# EAGLE design tfp401_board (EAGLE 6.6.0)

## Sheet 1 of 4
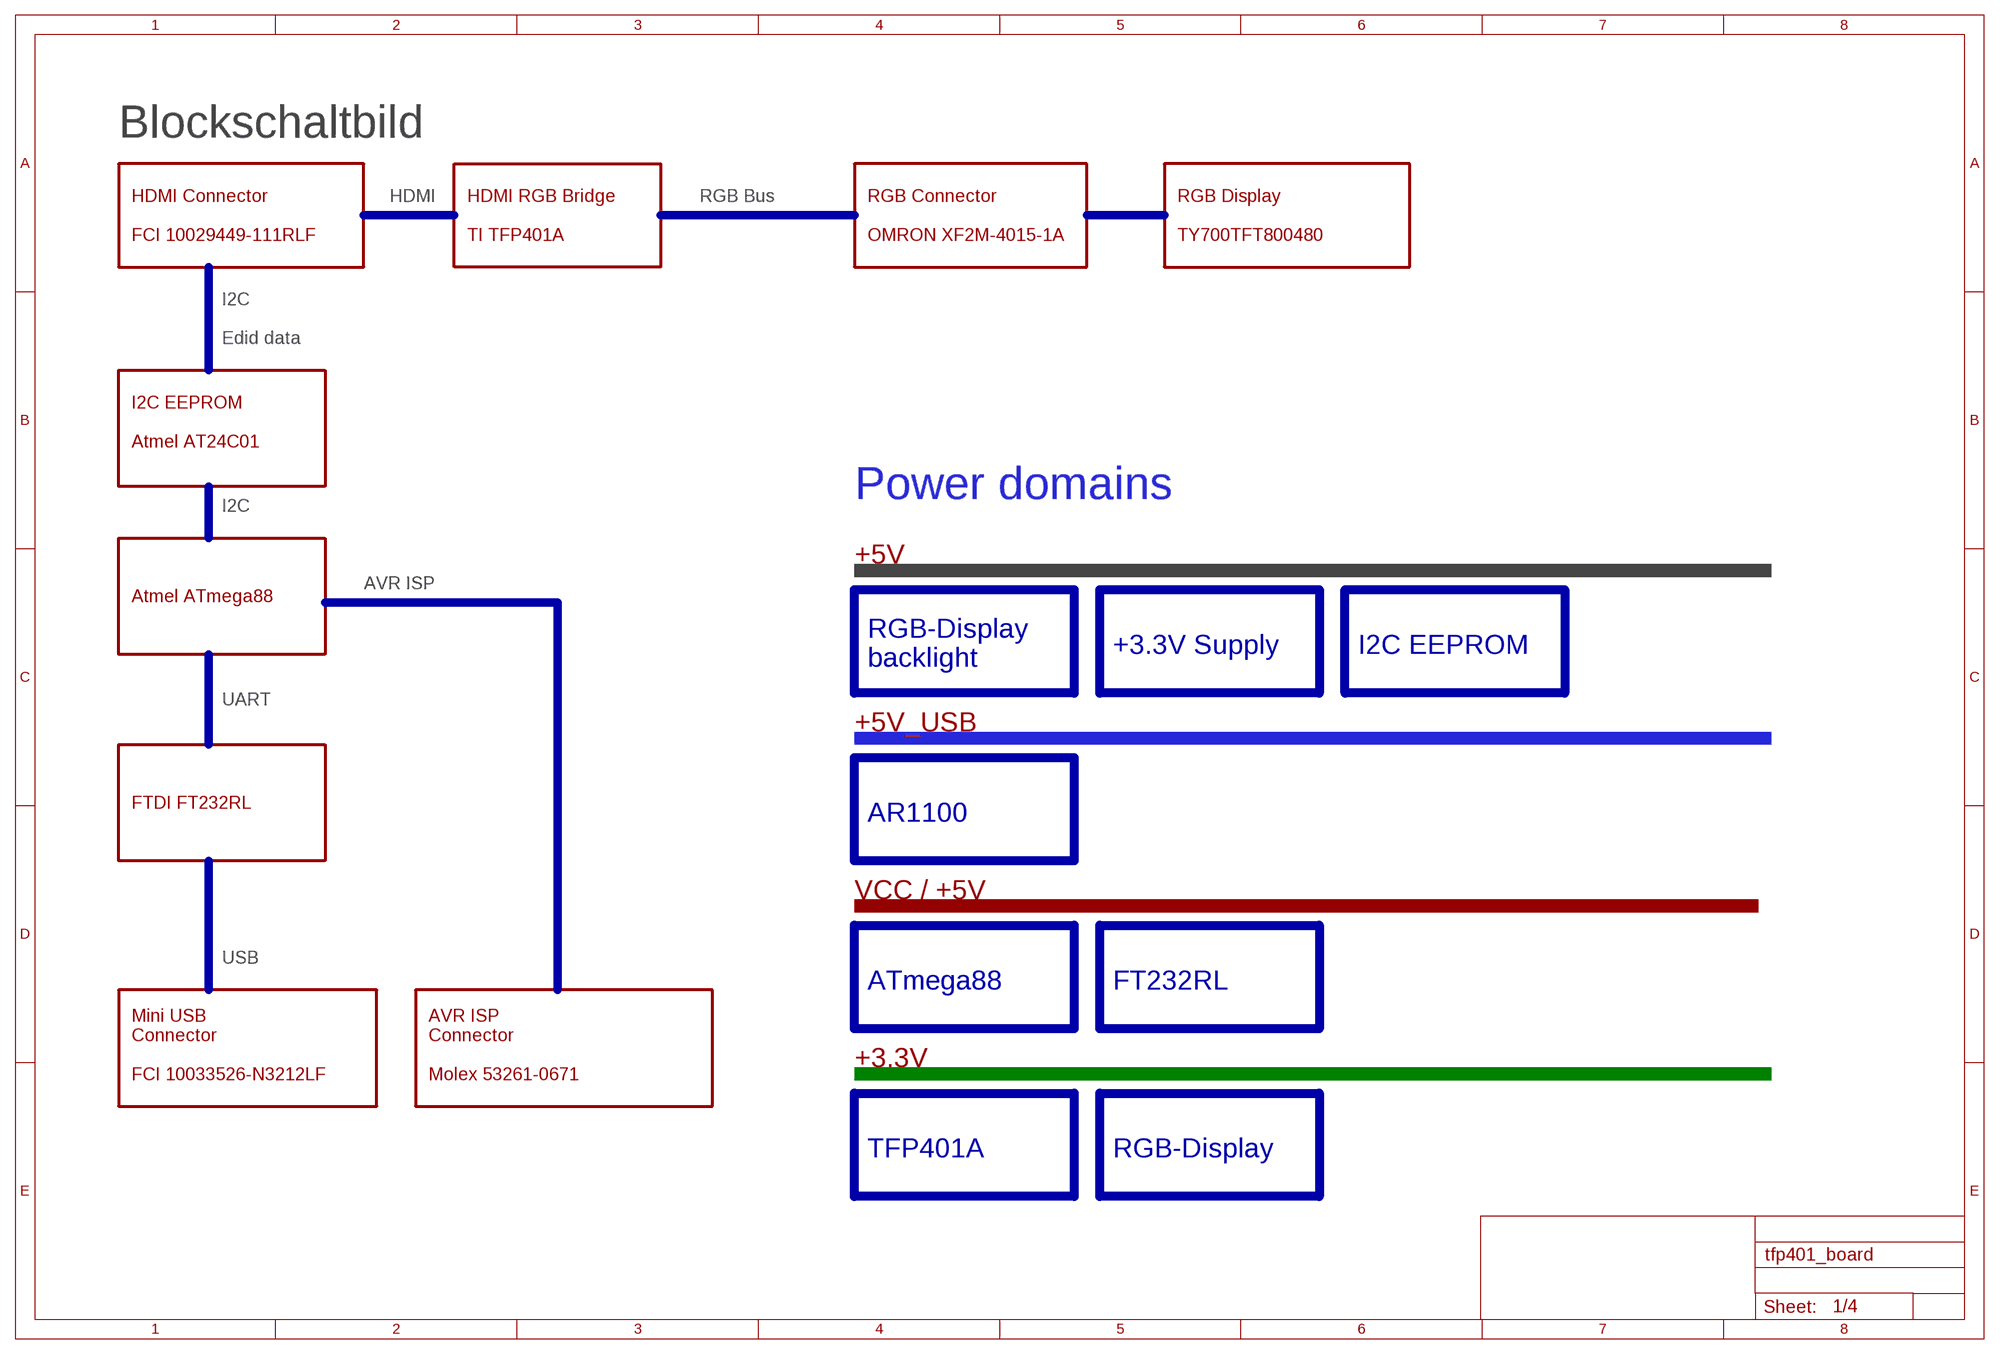
[diagram p0: schematic, sheet 1]

### Parts
U$15  FRAME_A3_LANDSCAPE  [FRAME]

### Buses
B$1
B$5
B$6
B$7
B$8
B$10
B$11
B$12

### Notes on the sheet
- Blockschaltbild
- HDMI | RGB Bus
- HDMI Connector
  
  FCI 10029449-111RLF
- HDMI RGB Bridge
  
  TI TFP401A
- RGB Connector
  
  OMRON XF2M-4015-1A
- RGB Display
  
  TY700TFT800480
- I2C
- Edid data
- I2C EEPROM
  
  Atmel AT24C01
- Power domains
- I2C
- +5V
- AVR ISP
- Atmel ATmega88
- +3.3V Supply | I2C EEPROM
- RGB-Display
  backlight
- UART
- +5V_USB
- FTDI FT232RL
- AR1100
- VCC / +5V
- USB
- ATmega88 | FT232RL
- +3.3V
- Mini USB
  Connector
  
  FCI 10033526-N3212LF
- AVR ISP
  Connector
  
  Molex 53261-0671
- TFP401A | RGB-Display

## Sheet 2 of 4
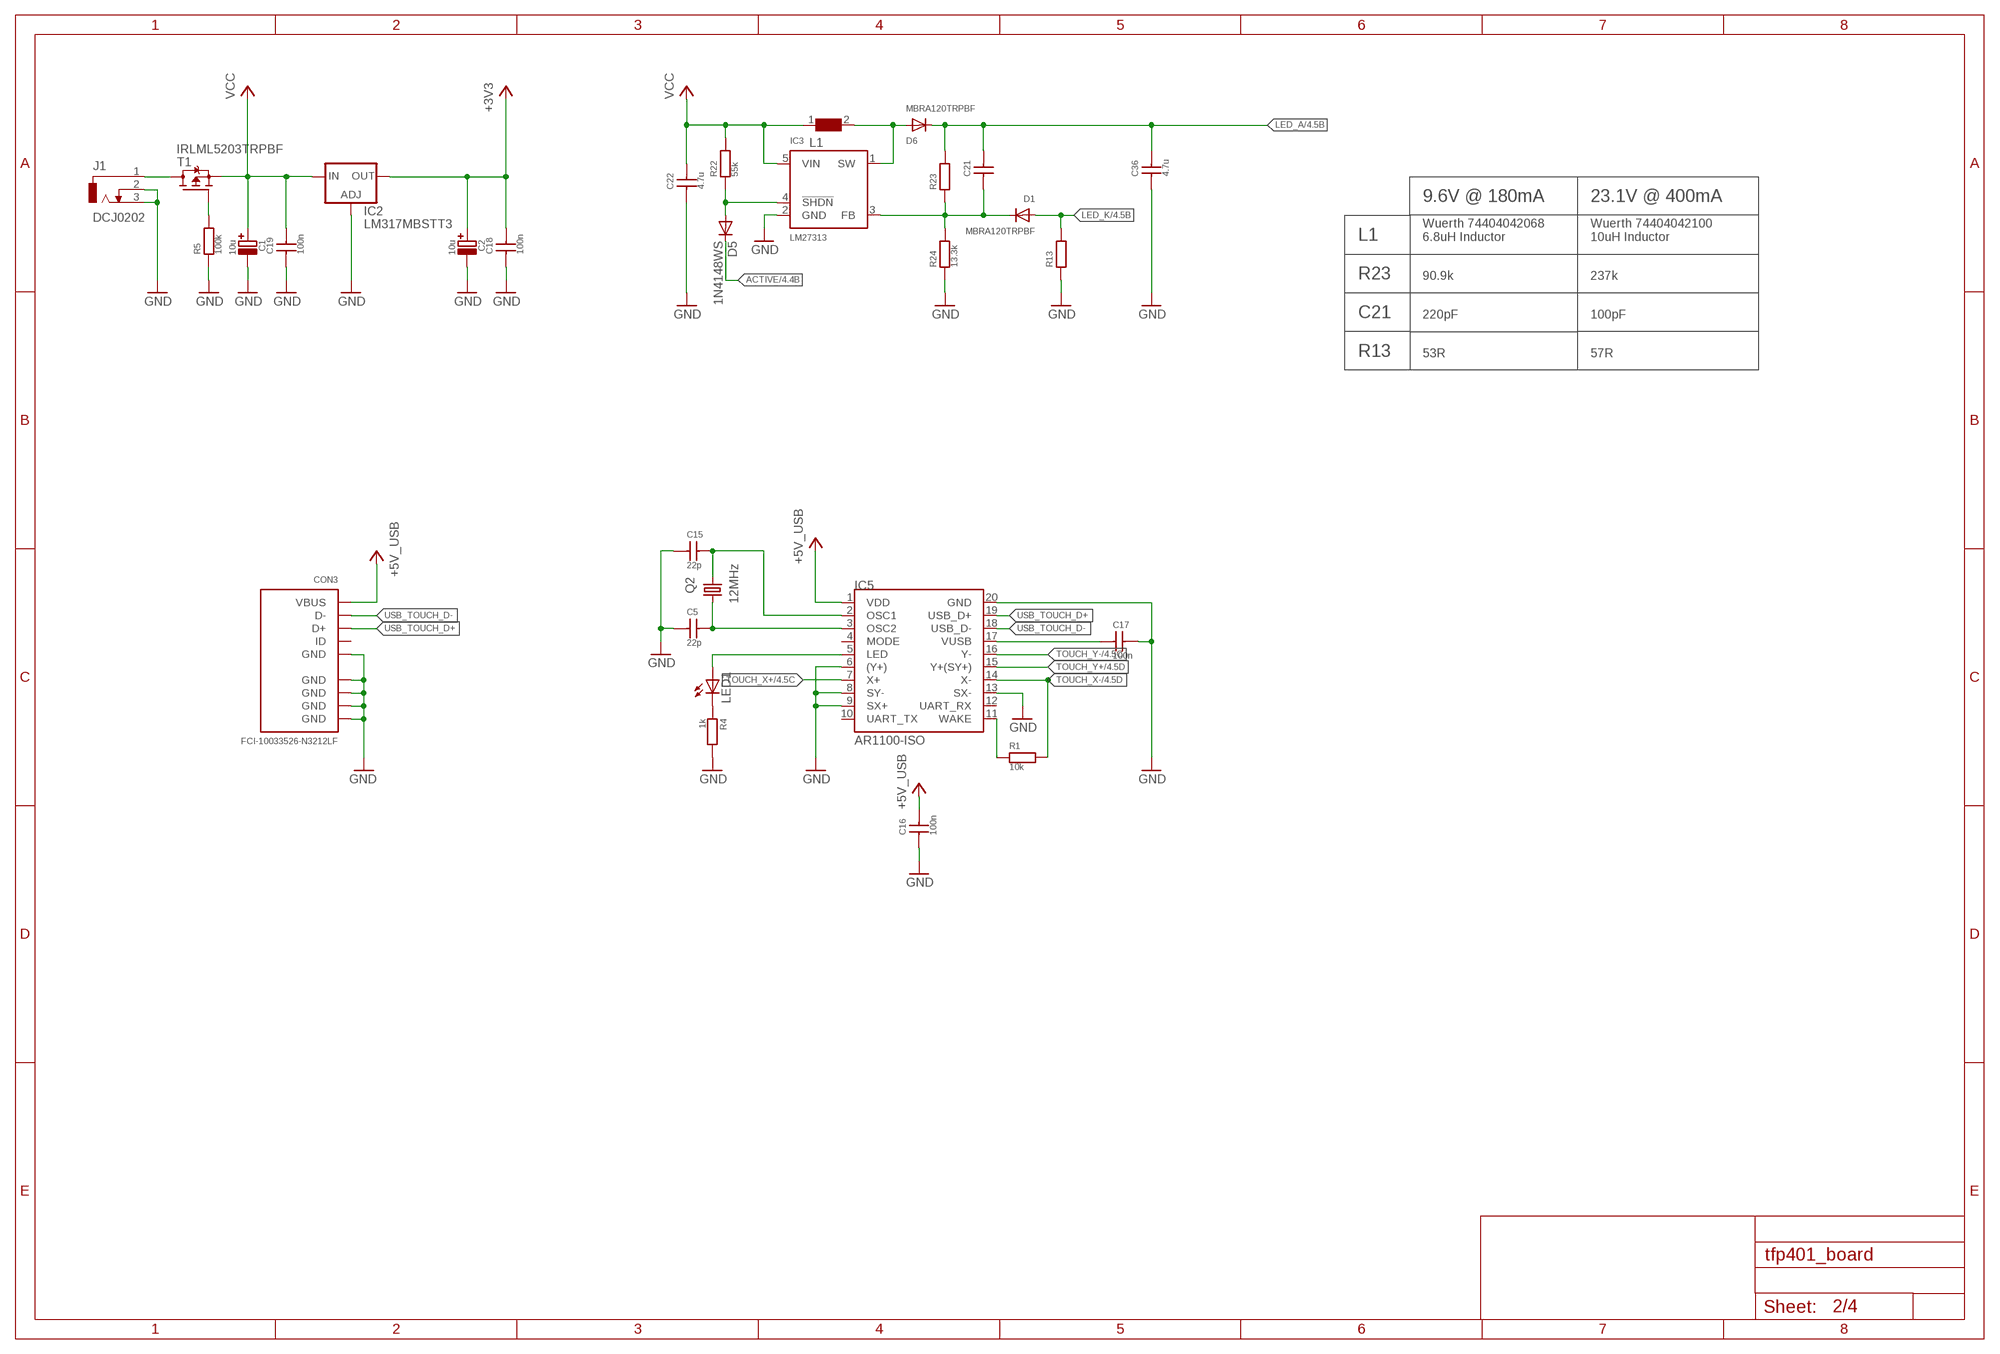
[diagram p1: schematic, sheet 2]

### Parts
C1  10u  C_POL4X4MM  [C_POL_4X4MM]
C2  10u  C_POL4X4MM  [C_POL_4X4MM]
C5  22p  C_SMD0603  [C0603]
C15  22p  C_SMD0603  [C0603]
C16  100n  C_SMD0603  [C0603]
C17  100n  C_SMD0603  [C0603]
C18  100n  C_SMD0603  [C0603]
C19  100n  C_SMD0603  [C0603]
C21  C_SMD0603  [C0603]
C22  4.7u  C_SMD1206  [C1206]
C36  4.7u  C_SMD1206  [C1206]
CON3  FCI-10033526-N3212LF  [FCI-10033526-N3212LF]
D1  MBRA120TRPBF  DIODESMA  [SMADIODE]
D5  1N4148WS  DIODE-SOD323-W  [SOD323-W]
D6  MBRA120TRPBF  DIODESMA  [SMADIODE]
IC2  LM317MBSTT3  [SOT223]
IC3  LM27313  [SOT23-5]
IC5  AR1100-ISO  [SOIC20]
J1  DCJ0202  [DCJ0202]
L1  WE-LQS_4018  [WE-LQS_4018]
LED1  LEDCHIP-LED0805  [CHIP-LED0805]
Q2  12MHz  ATS073ASM-1  [HC49/USSM]
R1  10k  R0603  [R0603]
R4  1k  R0603  [R0603]
R5  100k  R0603  [R0603]
R13  R2512  [R2512]
R22  55k  R0603  [R0603]
R23  R0603  [R0603]
R24  13.3k  R0603  [R0603]
T1  IRLML5203TRPBF  [SOT23]
U$2  FRAME_A3_LANDSCAPE  [FRAME]

### Nets
+3V3: C2.+ C18.2 IC2.4(OUT) ; also sheet 4
+5V_USB: C16.2 CON3.1(VBUS) IC5.1(VDD)
ACTIVE: D5.C ; also sheet 4
GND: C1.- C2.- C5.1 C15.1 C16.1 C17.2 C18.1 C19.1 C22.1 C36.1 CON3.5(GND) CON3.GND@1(GND) CON3.GND@2(GND) CON3.GND@3(GND) CON3.GND@4(GND) IC2.1(ADJ) IC3.2(GND) IC5.6((Y+)) IC5.8(SY-) IC5.9(SX+) IC5.13(SX-) IC5.20(GND) J1.2 J1.3 R4.2 R5.1 R13.1 R24.1 ; also sheet 3,4
LED_A: C21.2 C36.2 D6.C R23.2 ; also sheet 4
LED_K: D1.A R13.2 ; also sheet 4
N$1: R5.2 T1.1(G)
N$2: IC5.11(WAKE) R1.1
N$3: C17.1 IC5.17(VUSB)
N$4: LED1.C R4.1
N$5: C15.2 IC5.2(OSC1) Q2.1
N$6: J1.1 T1.3(D)
N$7: C5.2 IC5.3(OSC2) Q2.2
N$8: D6.A IC3.1(SW) L1.2
N$9: D5.A IC3.4(!SHDN) R22.1
N$10: IC5.5(LED) LED1.A
N$11: C21.1 D1.C IC3.3(FB) R23.1 R24.2
TOUCH_X+: IC5.7(X+) ; also sheet 4
TOUCH_X-: IC5.14(X-) R1.2 ; also sheet 4
TOUCH_Y+: IC5.15(Y+(SY+)) ; also sheet 4
TOUCH_Y-: IC5.16(Y-) ; also sheet 4
USB_TOUCH_D+: CON3.3(D+) IC5.19(USB_D+)
USB_TOUCH_D-: CON3.2(D-) IC5.18(USB_D-)
VCC: C1.+ C19.2 C22.2 IC2.3(IN) IC3.5(VIN) L1.1 R22.2 T1.2(S) ; also sheet 3,4
Unconnected: CON3.4(ID) IC5.4(MODE) IC5.10(UART_TX) IC5.12(UART_RX)

### Notes on the sheet
- 9.6V @ 180mA | 23.1V @ 400mA
- L1
- Wuerth 74404042068
  6.8uH Inductor
- Wuerth 74404042100
  10uH Inductor
- R23 | 90.9k | 237k
- C21 | 220pF | 100pF
- R13 | 53R | 57R

## Sheet 3 of 4
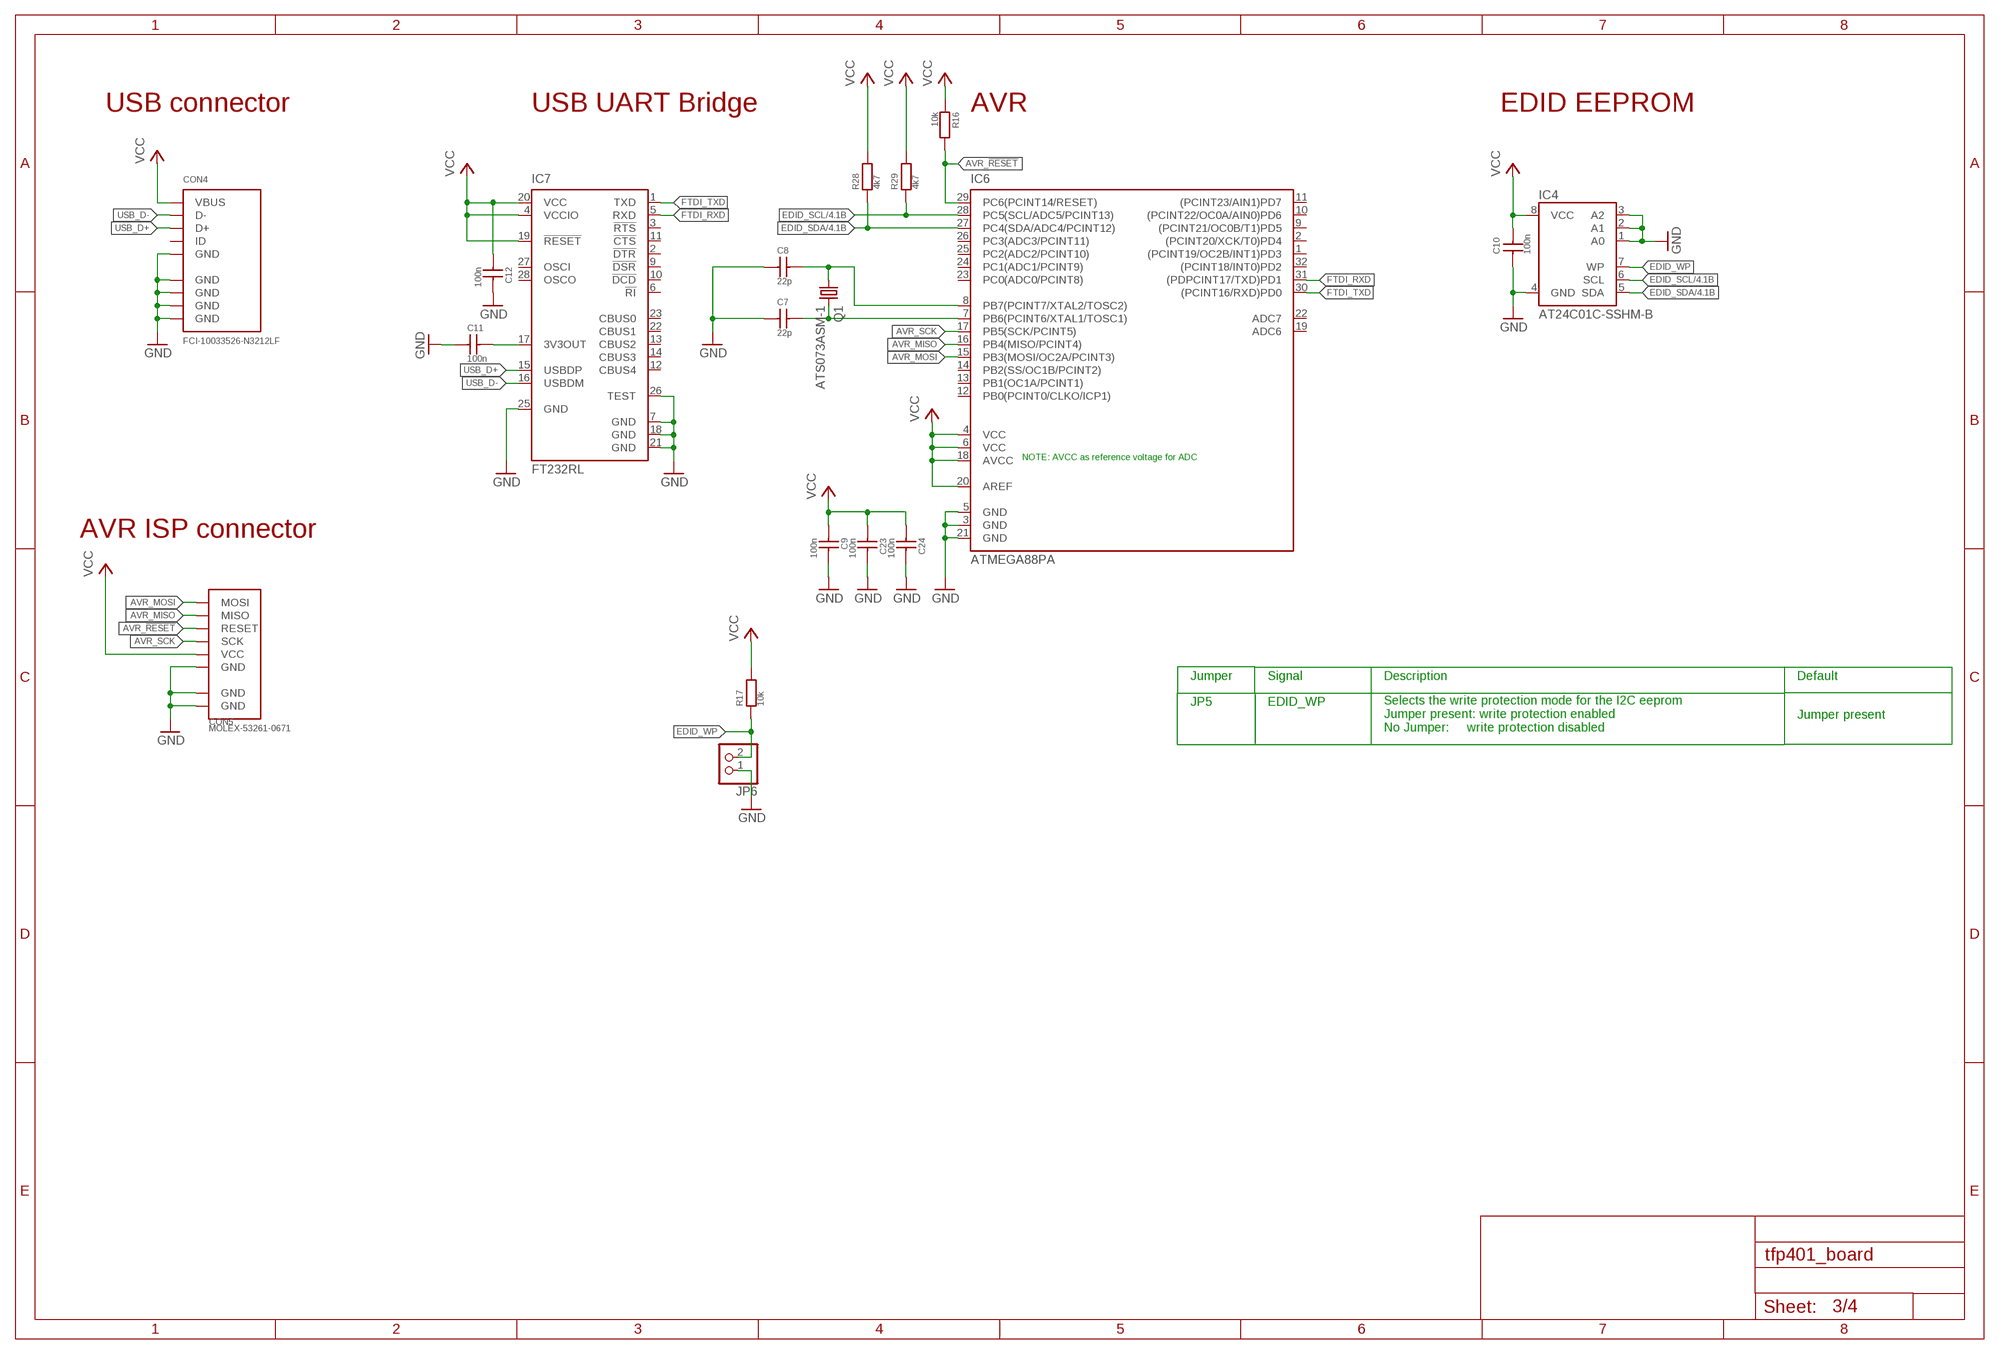
[diagram p2: schematic, sheet 3]

### Parts
C7  22p  C_SMD0603  [C0603]
C8  22p  C_SMD0603  [C0603]
C9  100n  C_SMD0603  [C0603]
C10  100n  C_SMD0603  [C0603]
C11  100n  C_SMD0603  [C0603]
C12  100n  C_SMD0603  [C0603]
C23  100n  C_SMD0603  [C0603]
C24  100n  C_SMD0603  [C0603]
CON4  FCI-10033526-N3212LF  [FCI-10033526-N3212LF]
CON5  MOLEX-53261-0671  [MOLEX-53261-0671]
IC4  AT24C01C-SSHM-B  [SOIC8]
IC6  ATMEGA88PA  ATMEGA48A-AU  [TQFP32]
IC7  FT232RL  [SSOP28]
JP6  PINHD-1X02_2.54-SMD-90°  [1X02SMD/90]
Q1  ATS073ASM-1  [HC49/USSM]
R16  10k  R0603  [R0603]
R17  10k  R0603  [R0603]
R28  4k7  R0603  [R0603]
R29  4k7  R0603  [R0603]
U$4  FRAME_A3_LANDSCAPE  [FRAME]

### Nets
AVR_!RESET: CON5.3(RESET) IC6.29(PC6(PCINT14/RESET)) R16.2
AVR_MISO: CON5.2(MISO) IC6.16(PB4(MISO/PCINT4))
AVR_MOSI: CON5.1(MOSI) IC6.15(PB3(MOSI/OC2A/PCINT3))
AVR_SCK: CON5.4(SCK) IC6.17(PB5(SCK/PCINT5))
AVR_XTAL1: C7.2 IC6.7(PB6(PCINT6/XTAL1/TOSC1)) Q1.2
AVR_XTAL2: C8.2 IC6.8(PB7(PCINT7/XTAL2/TOSC2)) Q1.1
EDID_SCL: IC4.6(SCL) IC6.28(PC5(SCL/ADC5/PCINT13)) R29.1 ; also sheet 4
EDID_SDA: IC4.5(SDA) IC6.27(PC4(SDA/ADC4/PCINT12)) R28.1 ; also sheet 4
EDID_WP: IC4.7(WP) JP6.2 R17.1
FTDI_3V3OUT: C11.2 IC7.17(3V3OUT)
FTDI_RXD: IC6.31((PDPCINT17/TXD)PD1) IC7.5(RXD)
FTDI_TXD: IC6.30((PCINT16/RXD)PD0) IC7.1(TXD)
GND: C7.1 C8.1 C9.2 C10.1 C11.1 C12.2 C23.2 C24.2 CON4.5(GND) CON4.GND@1(GND) CON4.GND@2(GND) CON4.GND@3(GND) CON4.GND@4(GND) CON5.6(GND) CON5.GND@1(GND) CON5.GND@2(GND) IC4.1(A0) IC4.2(A1) IC4.3(A2) IC4.4(GND) IC6.3(GND) IC6.5(GND) IC6.21(GND) IC7.7(GND) IC7.18(GND) IC7.21(GND) IC7.25(GND) IC7.26(TEST) JP6.1 ; also sheet 2,4
USB_D+: CON4.3(D+) IC7.15(USBDP)
USB_D-: CON4.2(D-) IC7.16(USBDM)
VCC: C9.1 C10.2 C12.1 C23.1 C24.1 CON4.1(VBUS) CON5.5(VCC) IC4.8(VCC) IC6.4(VCC) IC6.6(VCC) IC6.18(AVCC) IC6.20(AREF) IC7.4(VCCIO) IC7.19(!RESET) IC7.20(VCC) R16.1 R17.2 R28.2 R29.2 ; also sheet 2,4
Unconnected: CON4.4(ID) IC6.1((PCINT19/OC2B/INT1)PD3) IC6.2((PCINT20/XCK/T0)PD4) IC6.9((PCINT21/OC0B/T1)PD5) IC6.10((PCINT22/OC0A/AIN0)PD6) IC6.11((PCINT23/AIN1)PD7) IC6.12(PB0(PCINT0/CLKO/ICP1)) IC6.13(PB1(OC1A/PCINT1)) IC6.14(PB2(SS/OC1B/PCINT2)) IC6.19(ADC6) IC6.22(ADC7) IC6.23(PC0(ADC0/PCINT8)) IC6.24(PC1(ADC1/PCINT9)) IC6.25(PC2(ADC2/PCINT10)) IC6.26(PC3(ADC3/PCINT11)) IC6.32((PCINT18/INT0)PD2) IC7.2(!DTR) IC7.3(!RTS) IC7.6(!RI) IC7.9(!DSR) IC7.10(!DCD) IC7.11(!CTS) IC7.12(CBUS4) IC7.13(CBUS2) IC7.14(CBUS3) IC7.22(CBUS1) IC7.23(CBUS0) IC7.27(OSCI) IC7.28(OSCO)

### Notes on the sheet
- USB connector | USB UART Bridge | AVR | EDID EEPROM
- NOTE: AVCC as reference voltage for ADC
- AVR ISP connector
- Jumper | Signal | Description | Default
- JP5 | EDID_WP
- Jumper present
- Selects the write protection mode for the I2C eeprom
  Jumper present: write protection enabled
  No Jumper:     write protection disabled

## Sheet 4 of 4
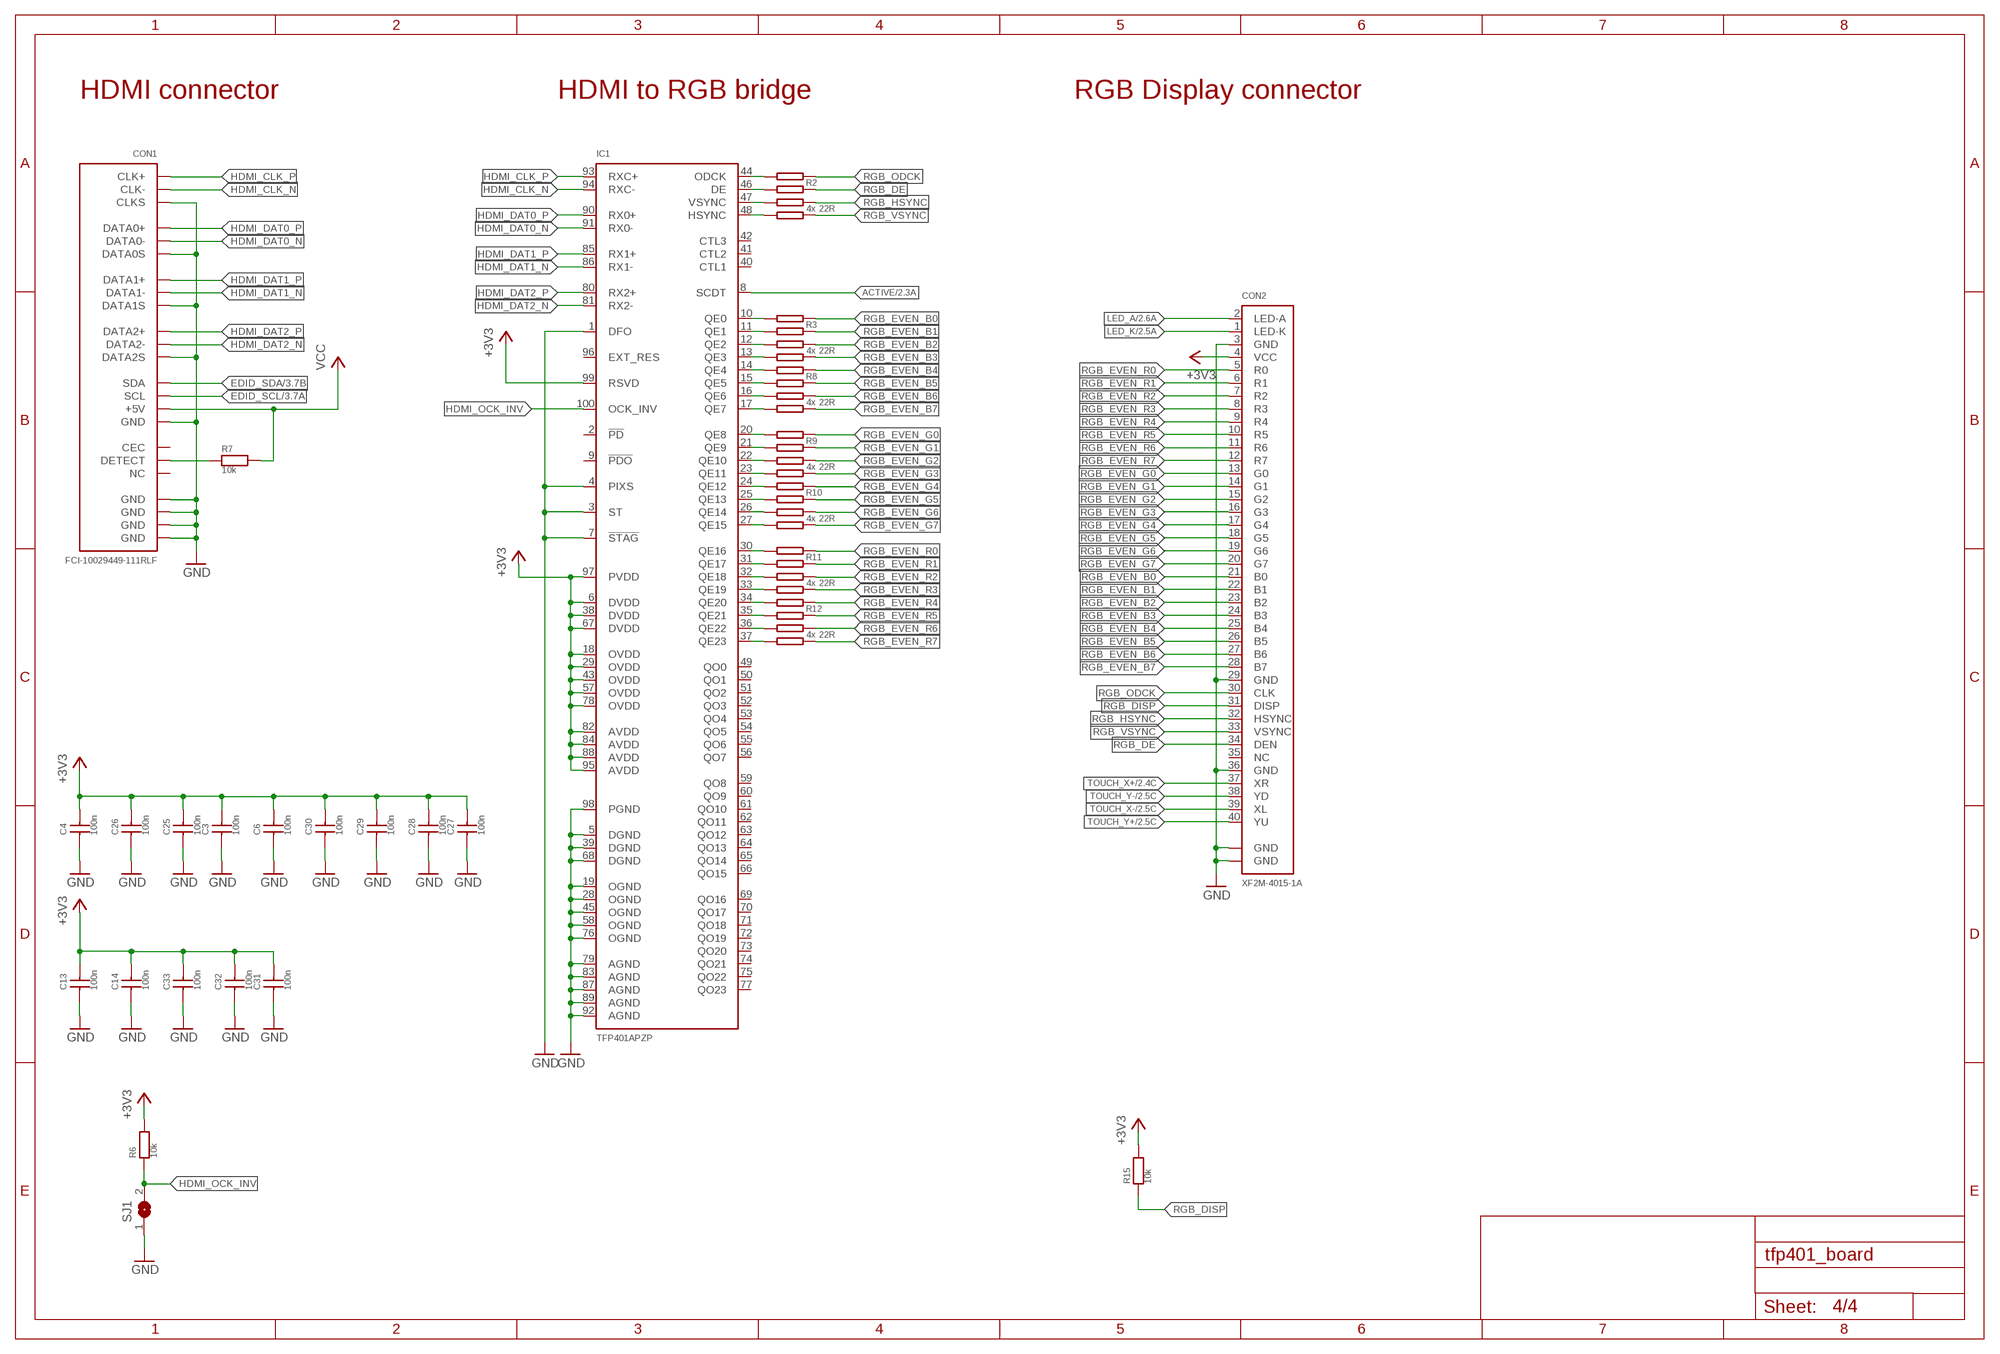
[diagram p3: schematic, sheet 4]

### Parts
C3  100n  C_SMD0603  [C0603]
C4  100n  C_SMD0603  [C0603]
C6  100n  C_SMD0603  [C0603]
C13  100n  C_SMD0603  [C0603]
C14  100n  C_SMD0603  [C0603]
C25  100n  C_SMD0603  [C0603]
C26  100n  C_SMD0603  [C0603]
C27  100n  C_SMD0603  [C0603]
C28  100n  C_SMD0603  [C0603]
C29  100n  C_SMD0603  [C0603]
C30  100n  C_SMD0603  [C0603]
C31  100n  C_SMD0603  [C0603]
C32  100n  C_SMD0603  [C0603]
C33  100n  C_SMD0603  [C0603]
CON1  FCI-10029449-111RLF  [FCI-10029449-111RLF]
CON2  XF2M-4015-1A  [XF2M-4015-1A]
IC1  TFP401APZP  [HTQFP-100]
R2  22R  CTR-742C083220JP-4X22R-4X0603  [R-ARRAY-4X0603]
R3  22R  CTR-742C083220JP-4X22R-4X0603  [R-ARRAY-4X0603]
R6  10k  R0603  [R0603]
R7  10k  R0603  [R0603]
R8  22R  CTR-742C083220JP-4X22R-4X0603  [R-ARRAY-4X0603]
R9  22R  CTR-742C083220JP-4X22R-4X0603  [R-ARRAY-4X0603]
R10  22R  CTR-742C083220JP-4X22R-4X0603  [R-ARRAY-4X0603]
R11  22R  CTR-742C083220JP-4X22R-4X0603  [R-ARRAY-4X0603]
R12  22R  CTR-742C083220JP-4X22R-4X0603  [R-ARRAY-4X0603]
R15  10k  R0603  [R0603]
SJ1  SJ  [SJ]
U$1  FRAME_A3_LANDSCAPE  [FRAME]

### Nets
+3V3: C3.2 C4.2 C6.2 C13.2 C14.2 C25.2 C26.2 C27.2 C28.2 C29.2 C30.2 C31.2 C32.2 C33.2 CON2.4(VCC) IC1.6(DVDD) IC1.18(OVDD) IC1.29(OVDD) IC1.38(DVDD) IC1.43(OVDD) IC1.57(OVDD) IC1.67(DVDD) IC1.78(OVDD) IC1.82(AVDD) IC1.84(AVDD) IC1.88(AVDD) IC1.95(AVDD) IC1.97(PVDD) IC1.99(RSVD) R6.2 R15.2 ; also sheet 2
ACTIVE: IC1.8(SCDT) ; also sheet 2
EDID_SCL: CON1.15(SCL) ; also sheet 3
EDID_SDA: CON1.16(SDA) ; also sheet 3
GND: C3.1 C4.1 C6.1 C13.1 C14.1 C25.1 C26.1 C27.1 C28.1 C29.1 C30.1 C31.1 C32.1 C33.1 CON1.2(DATA2S) CON1.5(DATA1S) CON1.8(DATA0S) CON1.11(CLKS) CON1.17(GND) CON1.GND@1(GND) CON1.GND@2(GND) CON1.GND@3(GND) CON1.GND@4(GND) CON2.3(GND) CON2.29(GND) CON2.36(GND) CON2.GND@1(GND) CON2.GND@2(GND) IC1.1(DFO) IC1.3(ST) IC1.4(PIXS) IC1.5(DGND) IC1.7(!STAG) IC1.19(OGND) IC1.28(OGND) IC1.39(DGND) IC1.45(OGND) IC1.58(OGND) IC1.68(DGND) IC1.76(OGND) IC1.79(AGND) IC1.83(AGND) IC1.87(AGND) IC1.89(AGND) IC1.92(AGND) IC1.98(PGND) SJ1.1 ; also sheet 2,3
HDMI_CLK_N: CON1.12(CLK-) IC1.94(RXC-)
HDMI_CLK_P: CON1.10(CLK+) IC1.93(RXC+)
HDMI_DAT0_N: CON1.9(DATA0-) IC1.91(RX0-)
HDMI_DAT0_P: CON1.7(DATA0+) IC1.90(RX0+)
HDMI_DAT1_N: CON1.6(DATA1-) IC1.86(RX1-)
HDMI_DAT1_P: CON1.4(DATA1+) IC1.85(RX1+)
HDMI_DAT2_N: CON1.3(DATA2-) IC1.81(RX2-)
HDMI_DAT2_P: CON1.1(DATA2+) IC1.80(RX2+)
HDMI_OCK_INV: IC1.100(OCK_INV) R6.1 SJ1.2
INT_RGB_DE: IC1.46(DE) R2.3M
INT_RGB_EVEN_B0: IC1.10(QE0) R3.4M
INT_RGB_EVEN_B1: IC1.11(QE1) R3.3M
INT_RGB_EVEN_B2: IC1.12(QE2) R3.2M
INT_RGB_EVEN_B3: IC1.13(QE3) R3.1M
INT_RGB_EVEN_B4: IC1.14(QE4) R8.4M
INT_RGB_EVEN_B5: IC1.15(QE5) R8.3M
INT_RGB_EVEN_B6: IC1.16(QE6) R8.2M
INT_RGB_EVEN_B7: IC1.17(QE7) R8.1M
INT_RGB_EVEN_G0: IC1.20(QE8) R9.4M
INT_RGB_EVEN_G1: IC1.21(QE9) R9.3M
INT_RGB_EVEN_G2: IC1.22(QE10) R9.2M
INT_RGB_EVEN_G3: IC1.23(QE11) R9.1M
INT_RGB_EVEN_G4: IC1.24(QE12) R10.4M
INT_RGB_EVEN_G5: IC1.25(QE13) R10.3M
INT_RGB_EVEN_G6: IC1.26(QE14) R10.2M
INT_RGB_EVEN_G7: IC1.27(QE15) R10.1M
INT_RGB_EVEN_R0: IC1.30(QE16) R11.4M
INT_RGB_EVEN_R1: IC1.31(QE17) R11.3M
INT_RGB_EVEN_R2: IC1.32(QE18) R11.2M
INT_RGB_EVEN_R3: IC1.33(QE19) R11.1M
INT_RGB_EVEN_R4: IC1.34(QE20) R12.4M
INT_RGB_EVEN_R5: IC1.35(QE21) R12.3M
INT_RGB_EVEN_R6: IC1.36(QE22) R12.2M
INT_RGB_EVEN_R7: IC1.37(QE23) R12.1M
INT_RGB_HSYNC: IC1.47(VSYNC) R2.2M
INT_RGB_ODCK: IC1.44(ODCK) R2.4M
INT_RGB_VSYNC: IC1.48(HSYNC) R2.1M
LED_A: CON2.2(LED-A) ; also sheet 2
LED_K: CON2.1(LED-K) ; also sheet 2
N$18: CON1.19(DETECT) R7.1
RGB_DE: CON2.34(DEN) R2.3P
RGB_DISP: CON2.31(DISP) R15.1
RGB_EVEN_B0: CON2.21(B0) R3.4P
RGB_EVEN_B1: CON2.22(B1) R3.3P
RGB_EVEN_B2: CON2.23(B2) R3.2P
RGB_EVEN_B3: CON2.24(B3) R3.1P
RGB_EVEN_B4: CON2.25(B4) R8.4P
RGB_EVEN_B5: CON2.26(B5) R8.3P
RGB_EVEN_B6: CON2.27(B6) R8.2P
RGB_EVEN_B7: CON2.28(B7) R8.1P
RGB_EVEN_G0: CON2.13(G0) R9.4P
RGB_EVEN_G1: CON2.14(G1) R9.3P
RGB_EVEN_G2: CON2.15(G2) R9.2P
RGB_EVEN_G3: CON2.16(G3) R9.1P
RGB_EVEN_G4: CON2.17(G4) R10.4P
RGB_EVEN_G5: CON2.18(G5) R10.3P
RGB_EVEN_G6: CON2.19(G6) R10.2P
RGB_EVEN_G7: CON2.20(G7) R10.1P
RGB_EVEN_R0: CON2.5(R0) R11.4P
RGB_EVEN_R1: CON2.6(R1) R11.3P
RGB_EVEN_R2: CON2.7(R2) R11.2P
RGB_EVEN_R3: CON2.8(R3) R11.1P
RGB_EVEN_R4: CON2.9(R4) R12.4P
RGB_EVEN_R5: CON2.10(R5) R12.3P
RGB_EVEN_R6: CON2.11(R6) R12.2P
RGB_EVEN_R7: CON2.12(R7) R12.1P
RGB_HSYNC: CON2.32(HSYNC) R2.2P
RGB_ODCK: CON2.30(CLK) R2.4P
RGB_VSYNC: CON2.33(VSYNC) R2.1P
TOUCH_X+: CON2.37(XR) ; also sheet 2
TOUCH_X-: CON2.39(XL) ; also sheet 2
TOUCH_Y+: CON2.40(YU) ; also sheet 2
TOUCH_Y-: CON2.38(YD) ; also sheet 2
VCC: CON1.18(+5V) R7.2 ; also sheet 2,3
Unconnected: CON1.13(CEC) CON1.14(NC) CON2.35(NC) IC1.2(!PD) IC1.9(!PDO) IC1.40(CTL1) IC1.41(CTL2) IC1.42(CTL3) IC1.49(QO0) IC1.50(QO1) IC1.51(QO2) IC1.52(QO3) IC1.53(QO4) IC1.54(QO5) IC1.55(QO6) IC1.56(QO7) IC1.59(QO8) IC1.60(QO9) IC1.61(QO10) IC1.62(QO11) IC1.63(QO12) IC1.64(QO13) IC1.65(QO14) IC1.66(QO15) IC1.69(QO16) IC1.70(QO17) IC1.71(QO18) IC1.72(QO19) IC1.73(QO20) IC1.74(QO21) IC1.75(QO22) IC1.77(QO23) IC1.96(EXT_RES)

### Notes on the sheet
- HDMI connector | HDMI to RGB bridge | RGB Display connector

## Library data of the parts
C1 C2 = SchlegelAr_Master:C_POL: C Pol last modified: Armin Schlegel, 20.03.2014
C3-C19 C21-C33 C36 = SchlegelAr_Master:C_SMD: C SMD 0402, 0603, 0805, 1206 last modified: Armin Schlegel, 24.03.2014
CON1 = SchlegelAr_Master:FCI-10029449-111RLF: FCI-10029449-111RLF - HDMI, Displayport & DVI-Steckverbinder HDMI TYPE A RECEPT last modified: Armin Schlegel, 30.10.2014 http://de.mouser.com/ProductDetail/FCI/10029449-111RLF/?qs=%2Fha2pyFadug8U4IOZZI2jnut2zm2rFMAp8K8PcXPAIyrEGZ2XRAPnyrp%252b5pF2ZP7 http://portal.fciconnect.com/Comergent/en/US/adirect/fci?cmd=catProductDetail&showAddButton=true&productID=10029449111RLF
CON2 = SchlegelAr_Master:XF2M-4015-1A: Omron Electronics XF2M-4015-1A - FFC & FPC-Steckverbinder .5mm Rotary BackLock SMT Dual 40P Adhesv. last modified: Armin Schlegel, 28.04.2014 http://de.mouser.com/ProductDetail/Molex/54132-4062/?qs=%2Fha2pyFaduiie%252bDsDPE%252bbxxE%252byCORF54wAjQh9n3aQM%3D http://www.molex.com/pdm_docs/sd/541324062_sd.pdf
CON3 CON4 = SchlegelAr_Master:FCI-10033526-N3212LF: FCI-10033526-N3212LF - USB-Stecker MINIUSB B TYPE RT ANGLE RECEPTACLE last modified: Armin Schlegel, 28.04.2014 http://de.mouser.com/ProductDetail/FCI/10033526-N3212LF/?qs=%2Fha2pyFadujxDEaTCG%2F3IgsbFChSuv66JrkjaCBKgukjCIH%2FH4qAI7ajoEkcwwLO http://portal.fciconnect.com/Comergent//fci/drawing/10033526.pdf
CON5 = SchlegelAr_Master:MOLEX-53261-0671: MOLEX-53261-0671 - Molex picoblade 53261-0671 6 pol last modified: Armin Schlegel, 28.04.2014 http://de.mouser.com/ProductDetail/Molex/53261-0671/?qs=%2Fha2pyFadujL8XqTNrjzA%2Fy0AZso5hx2IWE7X8dEAdsn1tpb%2FKahAA%3D%3D http://www.mouser.com/ds/2/276/0532610671_PCB_HEADERS-170915.pdf
D1 D6 = adafruit:DIODE: Diode SMADIODE - SMA Surface Mount Package 20V 1A Schottky Diode Digikey: 641-1014-6-ND DO-1N4148 - Through Hole Small Current Diode SOD-123 20V 1 A (.5mV Vf) Schottky Diode - Digikey: MBRX120TPMSCT-ND SOD-323 10V 570mA (.38mV Vf, 3ns) Schottky Diode - Digikey: ZLLS410CT-ND SOD-523 30V 30mA Schottky Diode (RB751S-40TE61) - Digikey: RB751S-40TE61CT-ND SOT23-R/W - SOT23 Package (R = Solder Paste/Reflow Ovens, W = Hand-Soldering) BAT54Film 40V 300mA - Digikey: 497-7162-1-ND
D5 = diode:DIODE-: DIODE
IC1 = SchlegelAr_Master:TFP401APZP: TFP401APZP - Display-IC-Schnittstelle PanelBus DVI Rcvr 165MHz HSYNC fix last modified: Armin Schlegel, 28.04.2014 http://de.mouser.com/ProductDetail/Texas-Instruments/TFP401APZP/?qs=sGAEpiMZZMvzx35sqAbYyS%2FHXqUWhI80Lx8TsthrfGA%3D http://www.mouser.com/ds/2/405/slds120e-285347.pdf
IC2 = v-reg:LM317?*: 500 mA Adjustable Output Positive Voltage Regulator Source: http://www.onsemi.co.jp .. LM317M-D.PDF
IC3 = SchlegelAr_Master:LM27313: LM27313 1.6 MHz Boost Converter With 30V Internal FET Switch in SOT-23 http://www.ti.com/product/lm27313 Datasheet: http://www.ti.com/lit/gpn/lm27313
IC4 = SchlegelAr_Master:AT24C01C-SSHM-B: AT24C01C-SSHM-B - EEPROM 1K 2-WIRE 8 SOIC PB HALOFREE NiPdAu 1.7V last modified: Armin Schlegel, 20.03.2014 http://de.mouser.com/ProductDetail/Atmel/AT24C01C-SSHM-B/?qs=%2Fha2pyFaduiPyj5Xbzu3LDkZ5LRf3e5ZoZWa68Ku1XvnUdah058QnSJuuIfSMI6G http://www.mouser.com/ds/2/36/doc8700-75503.pdf
IC5 = SchlegelAr_Master:AR1100-ISO: AR 1100-ISO :: Touchscreen Steuerung, USB+RS-232, SOIC-20 http://www.reichelt.de/AR-1100-ISO/3/index.html?&ACTION=3&LA=446&ARTICLE=137267&artnr=AR+1100-ISO&SEARCH=AR1100 https://cdn-reichelt.de/documents/datenblatt/A300/DS_AR1100.pdf
IC6 = SchlegelAr_Master:ATMEGA48A-AU: ATMEGA48A-AU last modified: Armin Schlegel, 22.03.2014 http://de.mouser.com/ProductDetail/Atmel/ATMEGA48A-AU/?qs=sGAEpiMZZMvqv2n3s2xjse40PngS4U1xmCDanmh3raU%3D http://www.mouser.com/ds/2/36/doc8271-50296.pdf
IC7 = SchlegelAr_Master:FT232RL: FT232RL - USB-IC-Schnittstelle USB to Serial UART Enhanced IC last modified: Armin Schlegel, 28.04.2014 http://de.mouser.com/ProductDetail/FTDI/FT232RL-REEL/?qs=sGAEpiMZZMs5ceO8zL%252bTxyQLQIH6hE7q http://www.mouser.com/ds/2/163/DS_FT232R-11534.pdf
J1 = con-jack:DCJ0202: DC POWER JACK Source: DCJ0202.pdf; OC_FARNELL: unknown; OC_NEWARK: unknown
JP6 = pinhead-2:PINHD-1X02: PIN HEADER
L1 = EagleLibrary_Wuerth_Elektronik_eiSos_V6_20140807:WE-LQS_4018: SMD Shielded Tiny Power Inductor -Tiny Power Inductor design -1.7 times more current in comparison with unshielded versions - Robust design& high durability -Low RDC -Magnetically shielded wth magneticc glue reducing buzz noise in ultra-low levels -Operating Temperature:-40°C to +125°C -- Intergrated DC/DC Converters --Switching controllers which required high effiiciency --Portable power(Smartphones,digital cameras,Tablets,etc) --Embedded laptops and PCs --Big sizes(5040,60xx,8040) used for shock-proof circiuts <http://katalog.we-online.de/media/images/eisos/IndLQS_pf2.jpg> Details see: http://katalog.we-online.de/en/pbs/WE-LQS Created by Dan Xu 2014-05-21 2014 (C) Würth Elektronik
LED1 = led:LED: LED OSRAM: - CHIPLED LG R971, LG N971, LY N971, LG Q971, LY Q971, LO R971, LY R971 LH N974, LH R974 LS Q976, LO Q976, LY Q976 LO Q996 - Hyper CHIPLED LW Q18S LB Q993, LB Q99A, LB R99A - SideLED LS A670, LO A670, LY A670, LG A670, LP A670 LB A673, LV A673, LT A673, LW A673 LH A674 LY A675 LS A676, LA A676, LO A676, LY A676, LW A676 LS A679, LY A679, LG A679 - Hyper Micro SIDELED® LS Y876, LA Y876, LO Y876, LY Y876 LT Y87S - SmartLED LW L88C, LW L88S LB L89C, LB L89S, LG L890 LS L89K, LO L89K, LY L89K LS L896, LA L896, LO L896, LY L896 - TOPLED LS T670, LO T670, LY T670, LG T670, LP T670 LSG T670, LSP T670, LSY T670, LOP T670, LYG T670 LG T671, LOG T671, LSG T671 LB T673, LV T673, LT T673, LW T673 LH T674 LS T676, LA T676, LO T676, LY T676, LB T676, LH T676, LSB T676, LW T676 LB T67C, LV T67C, LT T67C, LS T67K, LO T67K, LY T67K, LW E67C LS E67B, LA E67B, LO E67B, LY E67B, LB E67C, LV E67C, LT E67C LW T67C LS T679, LY T679, LG T679 LS T770, LO T770, LY T770, LG T770, LP T770 LB T773, LV T773, LT T773, LW T773 LH T774 LS E675, LA E675, LY E675, LS T675 LS T776, LA T776, LO T776, LY T776, LB T776 LHGB T686 LT T68C, LB T68C - Hyper Mini TOPLED® LB M676 - Mini TOPLED Santana® LG M470 LS M47K, LO M47K, LY M47K Source: http://www.osram.convergy.de LUXEON: - LUMILED® LXK2-PW12-R00, LXK2-PW12-S00, LXK2-PW14-U00, LXK2-PW14-V00 LXK2-PM12-R00, LXK2-PM12-S00, LXK2-PM14-U00 LXK2-PE12-Q00, LXK2-PE12-R00, LXK2-PE12-S00, LXK2-PE14-T00, LXK2-PE14-U00 LXK2-PB12-K00, LXK2-PB12-L00, LXK2-PB12-M00, LXK2-PB14-N00, LXK2-PB14-P00, LXK2-PB14-Q00 LXK2-PR12-L00, LXK2-PR12-M00, LXK2-PR14-Q00, LXK2-PR14-R00 LXK2-PD12-Q00, LXK2-PD12-R00, LXK2-PD12-S00 LXK2-PH12-R00, LXK2-PH12-S00 LXK2-PL12-P00, LXK2-PL12-Q00, LXK2-PL12-R00 Source: www.luxeon.com KINGBRIGHT: KA-3528ASYC Source: www.kingbright.com
Q1 Q2 = SchlegelAr_Master:ATS073ASM-1: ATS073ASM-1 - Quarze 7.3728MHz Series 30ppm -20C 70C last modified: Armin Schlegel, 21.03.2014 http://de.mouser.com/ProductDetail/CTS-Electronic-Components/ATS073ASM-1/?qs=sGAEpiMZZMsBj6bBr9Q9aSLORZG%2fS%2fcqT3YYbKWRivQ%3d http://www.mouser.com/ds/2/96/008-0309-0-32667.pdf
R1 R4-R7 R13 R15-R17 R22-R24 R28 R29 = SchlegelAr_Master:R: Widerstaende in 0402, 0603, 0805, 1206, 2512 last modified: Armin Schlegel, 28.04.2014
R2 R3 R8-R12 = SchlegelAr_Master:CTR-742C083220JP-4X22R-4X0603: CTS-742C083220JP - Widerstandnetzwerke u. -Arrays 22ohms 50V 5% last modified: Armin Schlegel, 28.04.2014 http://de.mouser.com/ProductDetail/CTS/742C083220JP/?qs=%2Fha2pyFadugZw%2FZ8FzXmJjgugrSX4rX8irC%252bdOVCTeo59FWpXkhYqw%3D%3D http://pdf1.alldatasheet.net/datasheet-pdf/view/159746/CTS/741X083220JP.html
SJ1 = jumper:SJ: SMD solder JUMPER
T1 = SchlegelAr_Master:IRLML5203TRPBF: IRLML5203TRPBF - MOSFET MOSFT P-Ch -30V -3A 98mOhm 9.5nC Log Lvl last modified: Armin Schlegel, 28.04.2014 http://de.mouser.com/ProductDetail/International-Rectifier/IRLML5203TRPBF/?qs=sGAEpiMZZMshyDBzk1%2fWi5%252bqVgN3%252bWS8t7qb9msI9Rk%3d http://www.mouser.com/ds/2/200/irlml5203pbf-223113.pdf
U$1 U$2 U$4 U$15 = SchlegelAr_Master:FRAME_A3_LANDSCAPE: A3 Frame querformat last modified: Armin Schlegel, 20.03.2014

## Board
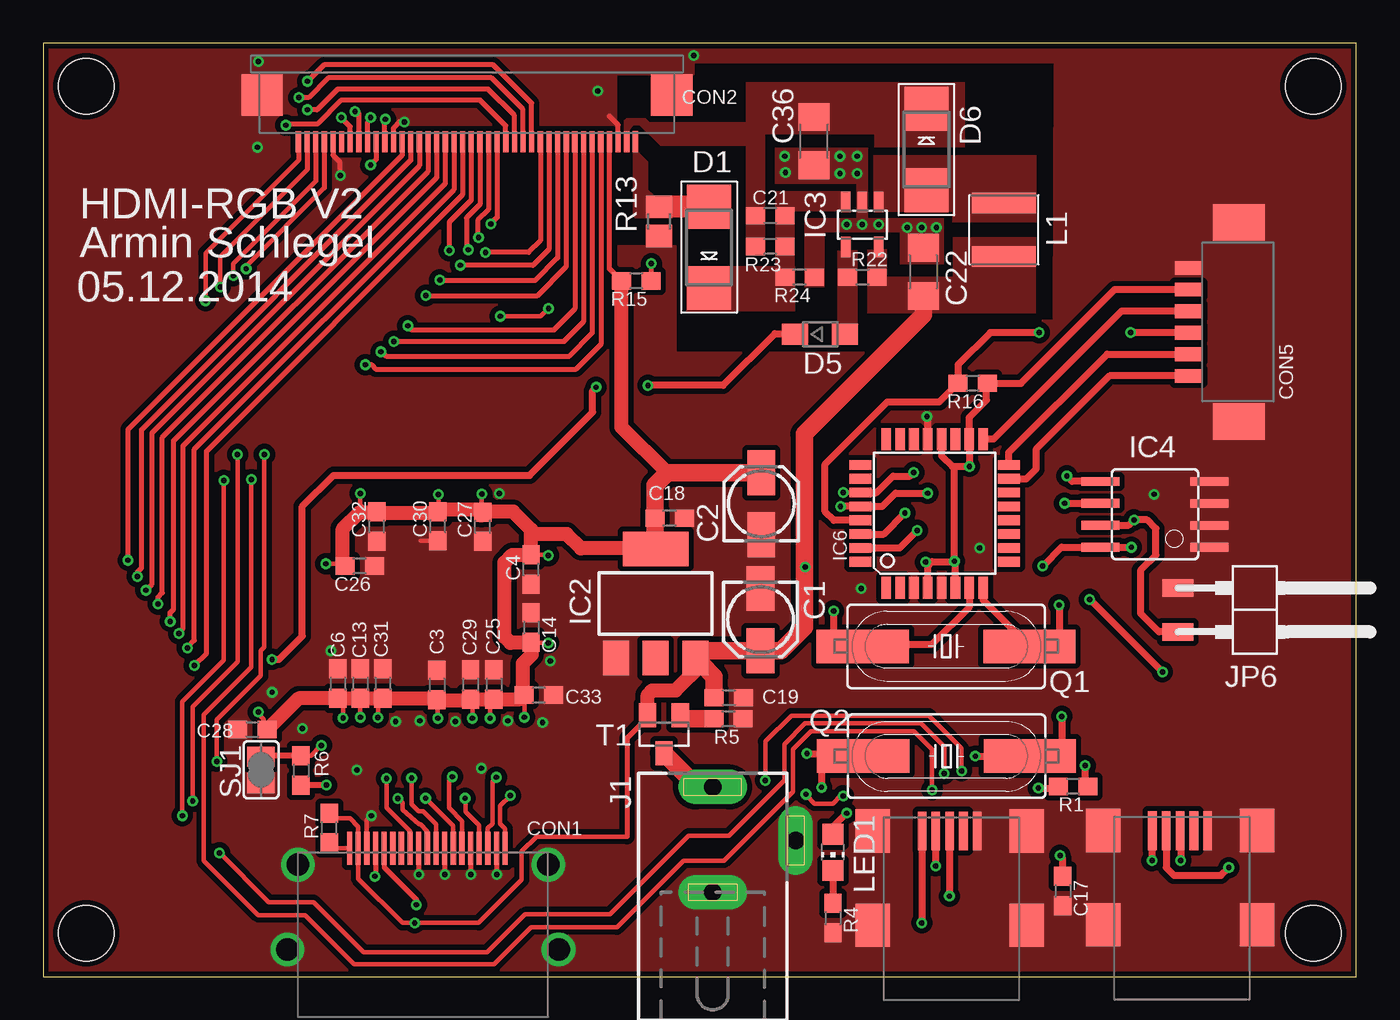
[diagram p4: board, top side]
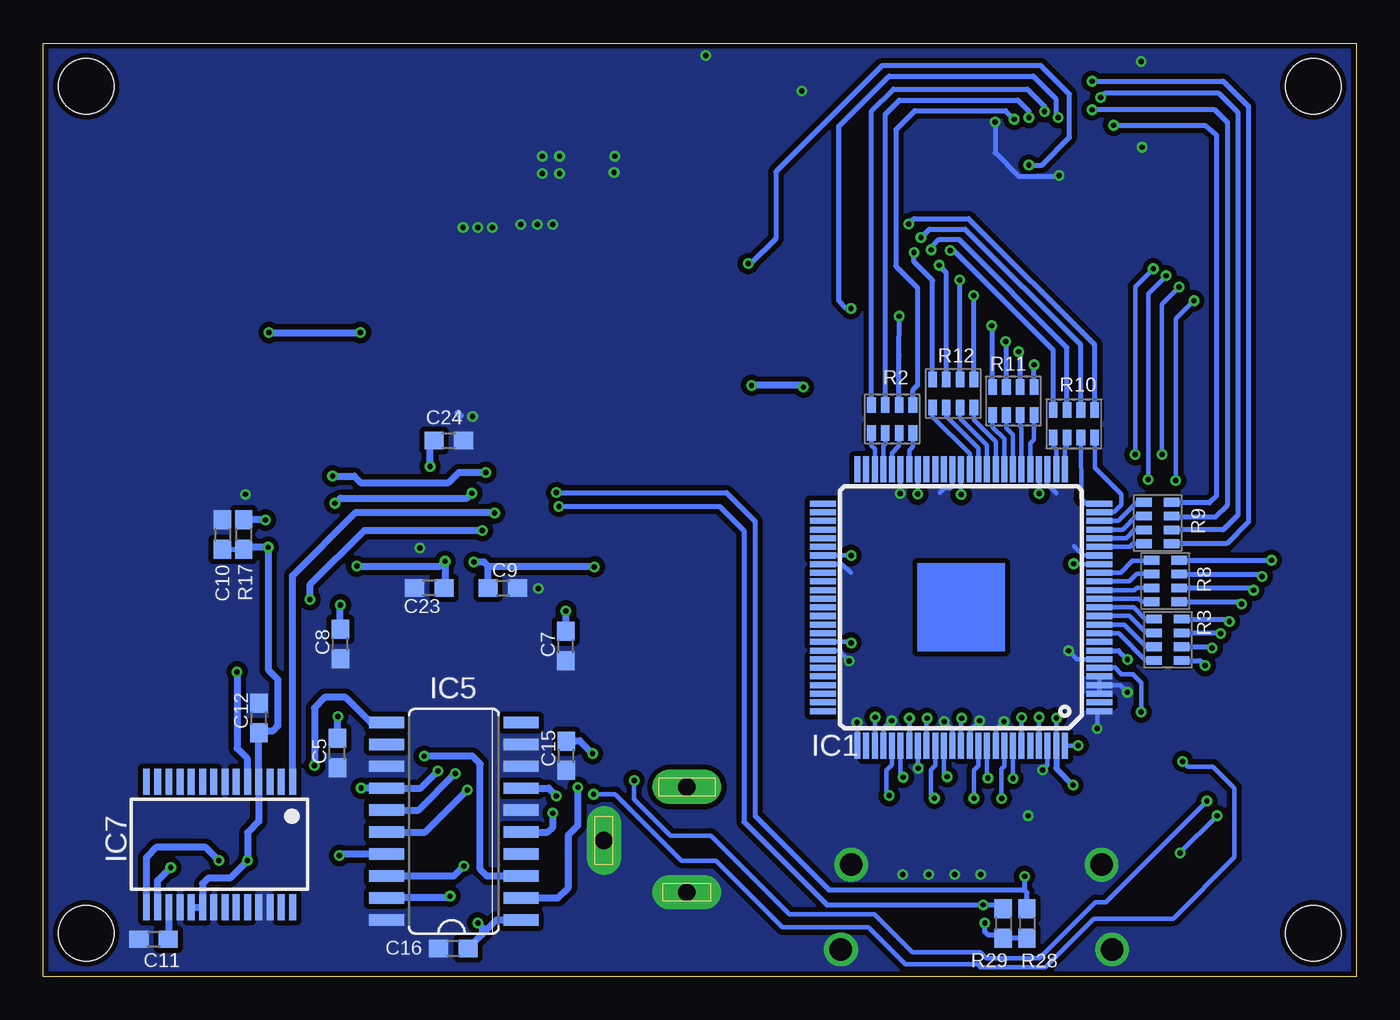
[diagram p5: board, bottom side, seen from below]

Size 76 x 54 mm. Coordinates in mm from the lower left corner, seen from the top.
Outline: 0,0 76,0 76,54 0,54 0,0
Copper layers (1*16): Top 0.035mm / dielectric 1.5mm / Bottom 0.035mm
Design rules "ITEADstudio_DRC": minimum track width 6mil, minimum drill 12mil, track to track 6mil, track to pad 6mil, pad to pad 6mil, via to via 6mil, smd to smd 0mil, copper to edge 10mil, drill to drill 10mil, minimum pad ring 10mil, minimum via ring 6mil, stop-mask expansion 2mil, vias tented up to drill 100mil, thermal gap 10mil
Holes 3.2 mm at 2.5,51.5 73.5,51.5 73.5,2.5 2.5,2.5

### Footprints (pad centres in the part's own frame; a part is rotated, then mirrored left to right if it is on the bottom)
C_POL_4X4MM = smd 2.6 x 1.6: + 1.8,0; - -1.8,0
C0603 = smd 1.1 x 1: 1 -0.85,0; 2 0.85,0
C1206 = smd 1.6 x 1.8: 1 -1.4,0; 2 1.4,0
FCI-10029449-111RLF = smd 0.3 x 1.9: 1 4.75,1; 2 4.25,1; 3 3.75,1; 4 3.25,1; 5 2.75,1; 6 2.25,1; 7 1.75,1; 8 1.25,1; 9 0.75,1; 10 0.25,1; 11 -0.25,1; 12 -0.75,1; 13 -1.25,1; 14 -1.75,1; 15 -2.25,1; 16 -2.75,1; 17 -3.25,1; 18 -3.75,1; 19 -4.25,1 | drill 1.3: GND@1 -7.25,0.05; GND@2 -7.85,-4.85; GND@3 7.25,0.05; GND@4 7.85,-4.85
XF2M-4015-1A = smd 0.3 x 1.2: 1 -9.75,2.5; 2 -9.25,2.5; 3 -8.75,2.5; 4 -8.25,2.5; 5 -7.75,2.5; 6 -7.25,2.5; 7 -6.75,2.5; 8 -6.25,2.5; 9 -5.75,2.5; 10 -5.25,2.5; 11 -4.75,2.5; 12 -4.25,2.5; 13 -3.75,2.5; 14 -3.25,2.5; 15 -2.75,2.5; 16 -2.25,2.5; 17 -1.75,2.5; 18 -1.25,2.5; 19 -0.75,2.5; 20 -0.25,2.5; 21 0.25,2.5; 22 0.75,2.5; 23 1.25,2.5; 24 1.75,2.5; 25 2.25,2.5; 26 2.75,2.5; 27 3.25,2.5; 28 3.75,2.5; 29 4.25,2.5; 30 4.75,2.5; 31 5.25,2.5; 32 5.75,2.5; 33 6.25,2.5; 34 6.75,2.5; 35 7.25,2.5; 36 7.75,2.5; 37 8.25,2.5; 38 8.75,2.5; 39 9.25,2.5; 40 9.75,2.5 | smd 2.4 x 2.4: GND@1 -11.85,-0.2; GND@2 11.85,-0.2
FCI-10033526-N3212LF = smd 0.5 x 2.25: 1 -1.6,0.8; 2 -0.8,0.8; 3 0,0.8; 4 0.8,0.8; 5 1.6,0.8 | smd 2 x 2.5: GND@1 -4.45,0.8; GND@2 -4.45,-4.65; GND@3 4.45,-4.65; GND@4 4.45,0.8
MOLEX-53261-0671 = smd 0.8 x 1.6: 1 -3.125,2.55; 2 -1.875,2.55; 3 -0.625,2.55; 4 0.625,2.55; 5 1.875,2.55; 6 3.125,2.55 | smd 2.1 x 3: GND@1 -5.75,-0.35; GND@2 5.75,-0.35
SMADIODE = smd 2.54 x 2.54: A 2.349,0; C -2.349,0
SOD323-W = smd 1.5 x 1.2: A 1.45,0; C -1.45,0
HTQFP-100 = smd 1.5 x 0.35: 1 -8,6; 2 -8,5.5; 3 -8,5; 4 -8,4.5; 5 -8,4; 6 -8,3.5; 7 -8,3; 8 -8,2.5; 9 -8,2; 10 -8,1.5; 11 -8,1; 12 -8,0.5; 13 -8,0; 14 -8,-0.5; 15 -8,-1; 16 -8,-1.5; 17 -8,-2; 18 -8,-2.5; 19 -8,-3; 20 -8,-3.5; 21 -8,-4; 22 -8,-4.5; 23 -8,-5; 24 -8,-5.5; 25 -8,-6; 51 8,-6; 52 8,-5.5; 53 8,-5; 54 8,-4.5; 55 8,-4; 56 8,-3.5; 57 8,-3; 58 8,-2.5; 59 8,-2; 60 8,-1.5; 61 8,-1; 62 8,-0.5; 63 8,0; 64 8,0.5; 65 8,1; 66 8,1.5; 67 8,2; 68 8,2.5; 69 8,3; 70 8,3.5; 71 8,4; 72 8,4.5; 73 8,5; 74 8,5.5; 75 8,6 | smd 0.35 x 1.5: 26 -6,-8; 27 -5.5,-8; 28 -5,-8; 29 -4.5,-8; 30 -4,-8; 31 -3.5,-8; 32 -3,-8; 33 -2.5,-8; 34 -2,-8; 35 -1.5,-8; 36 -1,-8; 37 -0.5,-8; 38 0,-8; 39 0.5,-8; 40 1,-8; 41 1.5,-8; 42 2,-8; 43 2.5,-8; 44 3,-8; 45 3.5,-8; 46 4,-8; 47 4.5,-8; 48 5,-8; 49 5.5,-8; 50 6,-8; 76 6,8; 77 5.5,8; 78 5,8; 79 4.5,8; 80 4,8; 81 3.5,8; 82 3,8; 83 2.5,8; 84 2,8; 85 1.5,8; 86 1,8; 87 0.5,8; 88 0,8; 89 -0.5,8; 90 -1,8; 91 -1.5,8; 92 -2,8; 93 -2.5,8; 94 -3,8; 95 -3.5,8; 96 -4,8; 97 -4.5,8; 98 -5,8; 99 -5.5,8; 100 -6,8
SOT223 = smd 1.5 x 2: 1 -2.3,-3.15; 2 0,-3.15; 3 2.3,-3.15 | smd 3.8 x 2: 4 0,3.15
SOT23-5 = smd 0.55 x 1.2: 1 -0.95,-1.3; 2 0,-1.3; 3 0.95,-1.3; 4 0.95,1.3; 5 -0.95,1.3
SOIC8 = smd 0.5 x 2.2: 1 -1.905,-3.154; 2 -0.645,-3.154; 3 0.625,-3.154; 4 1.895,-3.154; 5 1.905,3.154; 6 0.635,3.154; 7 -0.635,3.154; 8 -1.905,3.154
SOIC20 = smd 0.66 x 2.032: 1 -5.615,-4.129; 2 -4.345,-4.129; 3 -3.075,-4.129; 4 -1.805,-4.129; 5 -0.535,-4.129; 6 0.735,-4.129; 7 2.005,-4.129; 8 3.275,-4.129; 9 4.545,-4.129; 10 5.815,-4.129; 11 5.815,3.659; 12 4.545,3.659; 13 3.275,3.659; 14 2.005,3.659; 15 0.735,3.659; 16 -0.535,3.659; 17 -1.805,3.659; 18 -3.075,3.659; 19 -4.345,3.659; 20 -5.615,3.659
TQFP32 = smd 1.27 x 0.559: 1 -4.293,2.8; 2 -4.293,2; 3 -4.293,1.2; 4 -4.293,0.4; 5 -4.293,-0.4; 6 -4.293,-1.2; 7 -4.293,-2; 8 -4.293,-2.8; 17 4.293,-2.8; 18 4.293,-2; 19 4.293,-1.2; 20 4.293,-0.4; 21 4.293,0.4; 22 4.293,1.2; 23 4.293,2; 24 4.293,2.8 | smd 0.559 x 1.27: 9 -2.8,-4.293; 10 -2,-4.293; 11 -1.2,-4.293; 12 -0.4,-4.293; 13 0.4,-4.293; 14 1.2,-4.293; 15 2,-4.293; 16 2.8,-4.293; 25 2.8,4.293; 26 2,4.293; 27 1.2,4.293; 28 0.4,4.293; 29 -0.4,4.293; 30 -1.2,4.293; 31 -2,4.293; 32 -2.8,4.293
SSOP28 = smd 0.4 x 1.5: 1 -4.225,-3.625; 2 -3.575,-3.625; 3 -2.925,-3.625; 4 -2.275,-3.625; 5 -1.625,-3.625; 6 -0.975,-3.625; 7 -0.325,-3.625; 8 0.325,-3.625; 9 0.975,-3.625; 10 1.625,-3.625; 11 2.275,-3.625; 12 2.925,-3.625; 13 3.575,-3.625; 14 4.225,-3.625; 15 4.225,3.625; 16 3.575,3.625; 17 2.925,3.625; 18 2.275,3.625; 19 1.625,3.625; 20 0.975,3.625; 21 0.325,3.625; 22 -0.325,3.625; 23 -0.975,3.625; 24 -1.625,3.625; 25 -2.275,3.625; 26 -2.925,3.625; 27 -3.575,3.625; 28 -4.225,3.625
DCJ0202 = drill 1 pad 2 long: 1 0,3.1; 2 4.8,0; 3 0,-3
1X02SMD/90 = smd 1.016 x 1.778: 1 -1.27,-5.08; 2 1.27,-5.08
WE-LQS_4018 = smd 1.2 x 3.7: 1 -1.55,0; 2 1.55,0
CHIP-LED0805 = smd 1.2 x 1.2: A 0,-1.05; C 0,1.05
HC49/USSM = smd 5.334 x 1.93: 1 -4.826,0; 2 4.826,0
R0603 = smd 1.1 x 1: 1 -0.85,0; 2 0.85,0
R-ARRAY-4X0603 = smd 0.9 x 0.5: 1M -0.8,1.2; 1P 0.8,1.2; 2M -0.8,0.4; 2P 0.8,0.4; 3M -0.8,-0.4; 3P 0.8,-0.4; 4M -0.8,-1.2; 4P 0.8,-1.2
R2512 = smd 1.3 x 1.5: 1 -0.85,0; 2 0.85,0
SJ = smd 1.168 x 1.6: 1 -0.762,0; 2 0.762,0
SOT23 = smd 1 x 1.4: 1 -0.95,-1.1; 2 0.95,-1.1; 3 0,1.1

### Placement (x,y rotation side)
C1  41.52,20.65 270 top
C2  41.57,27.36 90 top
C3  22.79,16.88 270 top
C4  28.24,23.55 90 top
C5  58.98,12.93 90 bottom
C6  17.06,16.95 270 top
C7  45.75,19.11 90 bottom
C8  58.8,19.24 90 bottom
C9  49.39,22.48 0 bottom
C10  65.62,25.58 270 bottom
C11  69.61,2.16 0 bottom
C12  63.51,14.96 90 bottom
C13  18.35,16.95 270 top
C14  28.24,20.19 270 top
C15  45.72,12.78 90 bottom
C16  52.26,1.63 0 bottom
C17  59.01,4.95 270 top
C18  36.26,26.52 180 top
C19  39.69,16.13 180 top
C21  42.07,44.02 180 top
C22  50.94,40.77 270 top
C23  53.66,22.48 180 bottom
C24  52.51,31.01 0 bottom
C25  26.09,16.9 270 top
C26  18.32,23.76 180 top
C27  25.44,26.03 90 top
C28  12.11,14.29 0 top
C29  24.73,16.9 270 top
C30  22.85,26.05 90 top
C31  19.65,16.95 270 top
C32  19.31,26.04 90 top
C33  28.69,16.28 180 top
C36  44.61,48.34 90 top
CON1  21.98,6.42 0 top
CON2  24.52,50.8 180 top
CON3  52.46,7.62 0 top
CON4  65.8,7.65 0 top
CON5  68.85,37.87 90 top
D1  38.54,42.19 90 top
D5  44.96,37.16 0 top
D6  51.12,47.85 270 top
IC1  22.87,21.36 180 bottom
IC2  35.45,21.59 0 top
IC3  47.41,43.51 180 top
IC4  64.35,26.75 90 top
IC5  52.46,8.89 90 bottom
IC6  51.6,26.8 90 top
IC7  65.8,7.65 180 bottom
J1  38.75,7.87 0 top
JP6  70.75,21.21 270 top
L1  55.61,43.21 90 top
LED1  45.71,7.19 180 top
Q1  52.26,19.1 180 top
Q2  52.29,12.75 0 top
R1  59.61,11 180 top
R2  26.86,32.26 90 bottom
R3  10.91,19.48 0 bottom
R4  45.71,3.38 270 top
R5  39.66,14.91 180 top
R6  14.92,11.91 270 top
R7  16.56,8.6 90 top
R8  11.06,22.89 0 bottom
R9  11.49,26.24 0 bottom
R10  16.34,31.98 90 bottom
R11  19.85,33.3 90 bottom
R12  23.33,33.73 90 bottom
R13  35.65,43.69 90 top
R15  34.32,40.25 180 top
R16  53.79,34.32 180 top
R17  64.4,25.58 270 bottom
R22  47.41,40.46 0 top
R23  42.07,42.24 180 top
R24  43.78,40.46 180 top
R28  19.06,3.07 270 bottom
R29  20.43,3.07 270 bottom
SJ1  12.61,11.96 90 top
T1  35.93,14.02 180 top
U$1  10.55,0 0 top
U$2  10.55,0 0 top
U$4  10.55,0 0 top
U$15  10.55,0 0 top

### Tracks (layer width: path | path; a pad name or v marks a point on that pad's centre or on a via)
+3V3  (via drill 0.31)
  Top 0.254: 27.88,16.24 27.87,16.25 | 25.36,26.68 C27.2 25.39,26.93 v25.39,27.91 | v22.87,27.88 22.87,26.92 C30.2 | v16.36,23.88 17.34,23.88 C26.2 | C4.2 29.2,24.4 v29.24,24.36 | v29.24,19.3 28.28,19.3 C14.2 | 27.87,16.25 C33.2 | C25.2 25.86,15.83 v25.86,14.94 | v24.84,14.94 24.84,15.94 C29.2 | v22.84,14.94 22.84,15.97 C3.2 | v19.38,14.99 19.38,15.82 C31.2 | C13.2 18.37,16.08 18.35,16.06 v18.35,15 | v17.36,14.96 17.36,15.8 C6.2 | v12.45,15.3 12.45,15.2 12.75,14.9 12.75,14.51 C28.2 | 27.87,16.25 27.85,16.23 v27.85,15 | v18.35,27.95 18.35,27.3
  Top 0.3: 18.35,27.3 18.8,26.85 | R15.2 32.77,40.95 CON2.4
  Top 0.356: v16.39,11.07 14.93,11.07 R6.2
  Top 0.8: 25.36,26.68 25.36,26.94 25.3,27 22.95,27 C30.2 22.75,26.8 19.4,26.8 C32.2 19.27,26.85 18.8,26.85 18.3,26.85 17.34,25.89 17.34,23.88 | 28.24,25.45 C4.2 27.15,24.4 26.7,23.95 26.7,19.65 27.05,19.3 28.28,19.3 28.28,18.63 27.75,18.1 27.75,16.37 C33.2 27.61,16.05 C25.2 C29.2 24.66,15.97 22.84,15.97 | 28.24,25.45 28.24,25.86 27.2,26.9 25.46,26.9 C27.2 | C3.2 22.71,16.1 C31.2 C6.2 | C6.2 C13.2 | C6.2 14.8,16.1 12.99,14.29 C28.2 | 35.41,24.78 31.12,24.78 30.3,25.6 28.39,25.6 28.24,25.45 | 36.13,29.13 33.47,31.79 R15.2
  Top 1.016: IC2.4 35.41,24.78 C18.2 35.41,28.41 36.13,29.13 41.55,29.13 C2.+
  Bottom 0.254: IC1.6 14.85,17.88 13.98,17.88 13.6,17.5 13.08,17.5 13.07,17.49 12.94,17.49 12.45,17 v12.45,15.3 12.45,15.44 | IC1.38 v22.87,27.88 | IC1.43 25.37,27.92 v25.39,27.91 | IC1.57 v29.24,24.36 | IC1.67 29.3,19.36 v29.24,19.3 | IC1.84 24.87,14.91 v24.84,14.94 | IC1.88 22.87,14.9 v22.84,14.94 | IC1.95 v19.37,14.98 v19.38,14.99 | IC1.99 17.37,14.95 v17.36,14.96 | IC1.18 16.34,23.86 v16.36,23.88 | v18.35,15 18.37,14.98 IC1.97 | v27.85,15 27.87,14.98 IC1.78 | IC1.29 18.35,29.34 v18.35,27.95 | v25.86,14.94 25.87,14.93 IC1.82
  Bottom 0.356: IC1.99 17.37,12.05 v16.39,11.07
+5V_USB  (via drill 0.3)
  Top 0.406: CON3.1 50.85,8.41 v50.85,3.1
  Bottom 0.406: C16.2 50.59,2.44 | 50.59,2.44 49.76,3.27 IC5.1 | v50.85,3.1 50.59,2.84 50.59,2.44
ACTIVE  (via drill 0.3)
  Top 0.406: D5.C 43.47,37.2 42.35,37.2 39.35,34.2 v35,34.2 | v13.25,18.35 13.65,18.35 15,19.7 15,27.2 16.8,29 28.15,29 31.8,32.65 31.8,33.9 v32,34.1
  Bottom 0.3: IC1.8 13.76,18.86 v13.25,18.35
  Bottom 0.406: v32,34.1 32.1,34.2 v35,34.2
AVR_!RESET  (via drill 0.31)
  Top 0.406: CON5.3 62.94,37.25 v62.93,37.26 | v57.65,37.26 54.81,37.26 52.95,35.4 52.95,34.33 R16.2 51.87,33.25 48.85,33.25 45.25,29.65 45.25,26.9 45.75,26.4 IC6.29
  Bottom 0.406: v62.93,37.26 v57.65,37.26
AVR_MISO
  Top 0.406: IC6.16 55.89,30.33 61.58,36.02 66.28,36.02 CON5.2
AVR_MOSI
  Top 0.406: IC6.15 56.9,28.8 57.47,29.36 57.47,30.5 61.71,34.75 CON5.1
AVR_SCK
  Top 0.406: CON5.4 62.41,38.5 55,31.09 IC6.17
AVR_XTAL1  (via drill 0.3)
  Top 0.406: IC6.7 53.6,21.38 51.42,19.2 47.54,19.2 Q1.2 45.8,19.1 45.75,19.05 v45.75,21.15
  Bottom 0.406: C7.2 v45.75,21.15
AVR_XTAL2  (via drill 0.3)
  Top 0.406: IC6.8 54.4,21.79 Q1.1 58.8,19.1 v58.8,21.5
  Bottom 0.406: C8.2 v58.8,21.5
EDID_SCL  (via drill 0.3, 0.31)
  Top 0.3: CON1.15 19.73,6.32 21.6,4.45 v21.6,4.15
  Top 0.406: v51.19,27.96 49.34,27.96 48.57,27.2 IC6.28 v46.15,27.2 | v59.12,27.38 IC4.6
  Bottom 0.3: v46.15,27.2 36.85,27.2 35.45,25.8 35.45,8.95 30.65,4.15 v21.6,4.15 20.66,4.15 R29.1
  Bottom 0.406: v59.12,27.38 58.81,27.69 51.47,27.69 v51.19,27.96
EDID_SDA  (via drill 0.3, 0.31)
  Top 0.3: IC6.27 v46.3,28 | CON1.16 19.23,5.83 v19.2,5.8
  Top 0.406: IC6.27 48.23,28 49.19,28.96 50.18,28.96 v50.38,29.16 | IC4.5 59.55,28.65 v59.24,28.96
  Bottom 0.3: v46.3,28 36.45,28 34.8,26.35 34.8,9.3 30.5,5 19.2,5 | R28.1 19.06,4.86 19.2,5 | v19.2,5.8 19.2,5
  Bottom 0.406: v50.38,29.16 51.95,29.16 52.54,28.57 57.62,28.57 58,28.96 v59.24,28.96
EDID_WP  (via drill 0.31)
  Top 0.406: IC4.7 62.83,26.11 v63.13,26.42 63.9,26.42 64.4,25.91 64.4,24.38 63.51,23.5 63.51,21.01 64.58,19.94 JP6.2
  Bottom 0.406: v63.13,26.42 64.39,26.42 R17.1
FTDI_3V3OUT
  Bottom 0.406: IC7.17 68.72,2.19 C11.2
FTDI_RXD  (via drill 0.31)
  Top 0.406: IC6.31 49.57,24.8 v50.58,25.81 | v64.78,17.63 60.59,21.82 v60.57,21.82
  Bottom 0.406: v50.58,25.81 57.42,25.81 60.57,22.66 v60.57,21.82 | v64.78,17.63 64.78,13.21 64.17,12.6 IC7.5
FTDI_TXD  (via drill 0.31)
  Top 0.406: IC6.30 48.65,25.6 v49.87,26.82
  Bottom 0.406: v49.87,26.82 57.95,26.82 61.57,23.2 IC7.1
GND  (via drill 0.31)
  Top 0.254: C30.1 21.85,25.2 | CON1.17 18.73,9.03 v19,9.3
  Top 0.3: CON2.3 33.27,49.28 32.75,49.8 | CON2.29 20.27,49.07 20.7,49.5 v20.9,49.45 | CON1.2 26.23,5.92 v26.25,5.9 | CON1.5 24.73,6.12 24.8,6.05 | CON1.8 23.23,5.97 23.35,5.85 | CON1.11 21.73,5.97 21.8,5.9 | CON2.36 16.77,47.53 17.15,47.15 17.15,46.4 v17.2,46.35
  Top 0.406: IC6.21 51.2,32.4 v51.15,32.4
  Bottom 0.254: IC1.28 17.9,29.36 17.9,28.5 17.35,27.95 | IC1.19 15.81,24.36 16.35,24.9 | IC1.39 23.37,28.38 23.5,28.25 23.85,28.25 24.1,28 | IC1.45 26.37,27.98 v26.4,27.95 | IC1.92 20.87,14.28 v20.4,14.75 | IC1.87 23.37,14.27 v23.85,14.75 | IC1.89 22.37,14.23 v21.8,14.8 | IC1.98 17.87,12.23 v18.15,11.95 | IC1.79 27.37,14.33 v26.9,14.8 | IC1.4 13.66,16.86 v13.25,16.45 | v15,14.35 15,15.23 IC1.1 | IC1.3 IC1.4 | IC1.4 IC1.5 | IC1.7 16.16,18.36 v16.65,18.85 | IC1.83 25.37,12.07 v25.35,12.05 | IC1.76 28.87,14.67 v28.9,14.7 | IC1.68 29.96,18.86 v29.35,18.25 | IC1.58 29.76,23.86 29.25,23.35
  Bottom 0.3: v17.2,46.35 17.25,46.3 19.55,46.3 20.9,47.65 v20.9,49.45
  Bottom 0.406: 51.85,32.45 52,32.6
  other vias: 42.96,46.51 47.41,43.51 50,43.33 51.7,43.33 50.85,43.33 48.36,43.51 46.51,43.51 46.11,47.46 47.11,47.46 47.11,46.46 46.11,46.46 42.91,47.46 37.65,53.28 32.1,51.23 12.4,47.98 12.45,52.93 21.75,5.9 23.25,5.9 24.75,5.9 47.35,22.45 54.2,24.8 64.3,27.9
  pour Top (no thermals): 49.62,43.05 45.2,43.05 45.2,39.88 44.08,39.88 44.08,43.87 47.1,43.87 47.1,45.87 42.38,45.87 42.38,47.96 47.71,47.96 47.71,43.87 52.11,43.87 52.11,41.2 49.62,41.2
  pour Top (isolate 0.305, no thermals): 0,54 0,0 76,0 76,54 33.2,54 33.2,52.2 37.65,52.2 37.65,52.9 58.55,52.9 58.5,37.95 47.65,37.95 47.65,36.1 36.6,36.1 36.6,42.25 33.15,42.25 33.15,54
  pour Bottom (isolate 0.305, no thermals): 0,54 0,0 76,0 76,54
HDMI_CLK_N  (via drill 0.31)
  Top 0.152: 21.23,8.32 CON1.12
  Top 0.254: 21.23,8.32 21.23,8.42 19.87,9.78 v19.87,11.46
  Bottom 0.254: IC1.94 v19.87,11.46
HDMI_CLK_P  (via drill 0.31)
  Top 0.254: CON1.10 22.23,8.42 21.85,8.8 21.75,8.8 20.8,9.65 20.8,10.04 v20.53,10.31
  Bottom 0.152: v20.53,10.31 20.53,10.35 20.54,10.35
  Bottom 0.254: IC1.93 20.37,12.18 20.54,12.01 20.54,10.35 v20.54,10.31
HDMI_DAT0_N  (via drill 0.31)
  Top 0.254: v21.32,11.48 21.32,9.98 21.73,9.57 21.99,9.57 22.75,8.81 22.75,7.02 CON1.9
  Bottom 0.254: IC1.91 21.37,11.53 v21.32,11.48
HDMI_DAT0_P  (via drill 0.31)
  Top 0.254: CON1.7 23.73,8.71 v22.14,10.31
  Bottom 0.254: IC1.90 21.87,12.2 22.14,11.94 v22.14,10.31
HDMI_DAT1_N  (via drill 0.31)
  Top 0.254: CON1.6 24.24,7.03 24.24,8.99 23.48,9.75 23.48,11.35 v23.68,11.56
  Bottom 0.254: IC1.86 23.87,11.74 v23.68,11.56
HDMI_DAT1_P  (via drill 0.31)
  Top 0.254: CON1.4 25.23,8.76 24.46,9.53 24.46,10.28 v24.42,10.31
  Bottom 0.254: IC1.85 24.37,12.22 24.62,11.96 24.62,10.52 v24.42,10.31
HDMI_DAT2_N  (via drill 0.31)
  Top 0.254: CON1.3 25.73,8.57 26,8.83 26,11.3 v26.23,11.53
  Bottom 0.254: IC1.81 26.37,11.68 v26.23,11.53
HDMI_DAT2_P  (via drill 0.31)
  Top 0.254: CON1.1 26.73,8.55 26.45,8.83 26.45,9.88 v27.04,10.46
  Bottom 0.254: IC1.80 26.87,12.26 27.19,11.94 27.19,10.62 v27.04,10.46
HDMI_OCK_INV  (via drill 0.31)
  Top 0.254: 14.95,12.79 15.51,12.79 v16.1,13.37
  Top 0.356: 14.95,12.79 R6.1 12.65,12.76 SJ1.2
  Bottom 0.254: IC1.100 v16.11,13.36 v16.1,13.37
INT_RGB_DE
  Bottom 0.254: IC1.46 26.87,30.29 26.46,30.7 R2.3M
INT_RGB_EVEN_B0
  Bottom 0.254: IC1.10 13.75,19.86 12.17,18.28 R3.4M
INT_RGB_EVEN_B1
  Bottom 0.254: IC1.11 13.44,20.36 12.16,19.08 R3.3M
INT_RGB_EVEN_B2
  Bottom 0.254: IC1.12 13.13,20.86 12.15,19.88 R3.2M
INT_RGB_EVEN_B3
  Bottom 0.254: IC1.13 12.89,21.36 12.21,20.68 R3.1M
INT_RGB_EVEN_B4
  Bottom 0.254: IC1.14 12.58,21.86 12.41,21.69 R8.4M
INT_RGB_EVEN_B5
  Bottom 0.254: 11.88,22.5 R8.3M 11.88,22.5 12.7,22.5 12.84,22.36 IC1.15
INT_RGB_EVEN_B6
  Bottom 0.254: IC1.16 13.13,22.86 12.7,23.29 R8.2M
INT_RGB_EVEN_B7
  Bottom 0.254: R8.1M 11.9,24.05 12.95,24.05 13.64,23.36 IC1.17
INT_RGB_EVEN_G0
  Bottom 0.254: R9.4M 12.92,25.04 13.1,24.86 IC1.20
INT_RGB_EVEN_G1
  Bottom 0.254: IC1.21 13.31,25.36 12.84,25.84 R9.3M
INT_RGB_EVEN_G2
  Bottom 0.254: R9.2M 12.75,26.64 13.53,25.86 IC1.22
INT_RGB_EVEN_G3
  Bottom 0.254: R9.1M 12.71,27.44 13.79,26.36 IC1.23
INT_RGB_EVEN_G4
  Bottom 0.254: IC1.24 14.04,26.86 13.6,27.3 13.6,27.91 15.12,29.43 R10.4M
INT_RGB_EVEN_G5
  Bottom 0.254: R10.3M 15.92,27.64 15.64,27.36 IC1.25
INT_RGB_EVEN_G6
  Bottom 0.254: IC1.26 16.87,30.59 16.72,30.74 R10.2M
INT_RGB_EVEN_G7
  Bottom 0.254: R10.1M 17.52,30.66 17.37,30.52 IC1.27
INT_RGB_EVEN_R0
  Bottom 0.254: R11.4M 18.65,31.07 18.87,30.85 IC1.30
INT_RGB_EVEN_R1
  Bottom 0.254: IC1.31 19.37,31.73 19.45,31.81 R11.3M
INT_RGB_EVEN_R2
  Bottom 0.254: IC1.32 19.87,31.34 20.25,31.72 R11.2M
INT_RGB_EVEN_R3
  Bottom 0.254: IC1.33 20.37,31.1 21.05,31.78 R11.1M
INT_RGB_EVEN_R4
  Bottom 0.254: IC1.34 20.87,30.94 22.13,32.2 R12.4M
INT_RGB_EVEN_R5
  Bottom 0.254: IC1.35 21.37,30.73 22.93,32.29 R12.3M
INT_RGB_EVEN_R6
  Bottom 0.254: IC1.36 21.87,30.57 23.73,32.43 R12.2M
INT_RGB_EVEN_R7
  Bottom 0.254: IC1.37 22.37,30.23 24.53,32.39 R12.1M
INT_RGB_HSYNC
  Bottom 0.254: IC1.47 27.37,30.7 27.26,30.82 R2.2M
INT_RGB_ODCK
  Bottom 0.254: IC1.44 25.87,30.45 25.66,30.66 R2.4M
INT_RGB_VSYNC
  Bottom 0.254: IC1.48 27.87,30.53 28.06,30.71 R2.1M
LED_A
  pour Top (no thermals): 41.77,41.73 41.77,48.77 48.12,48.77 48.12,48.01 53.35,48.01 53.35,51.71 40.68,51.71 40.68,41.73
  pour Top (no thermals): 33.64,47.7 33.64,49.53 33.79,49.66 34.84,49.66 35.06,49.43 40.8,49.43 40.8,48.08 40.83,48.06 35.75,48.06 34.56,49.25 34.15,49.25 33.92,49.02 33.92,47.7
LED_K
  Top 1.27: D1.A R13.2
  pour Top (no thermals): 34.15,48.9 34.15,44.02 34.25,43.89 36.41,43.89 36.41,45.14 36.38,45.16 35.34,45.16 35.01,45.49 35.01,47.12 34.43,47.7 34.43,48.9
N$1
  Top 1.016: R5.2 37.09,14.91 T1.1
N$2  (via drill 0.31)
  Top 0.406: v60.3,12.2 60.3,11.16 R1.1
  Bottom 0.406: IC5.11 57.05,14.71 58.5,16.15 59.7,16.15 60.3,15.55 v60.3,12.2
N$3  (via drill 0.31)
  Top 0.406: C17.1 59.01,6.84 v58.85,7
  Bottom 0.406: IC5.17 58.77,7.08 v58.85,7
N$4
  Top 0.406: LED1.C R4.1
N$5  (via drill 0.3)
  Top 0.406: 45.95,12.75 45.75,12.95 45.7,12.9 v44.2,12.9 | 45.95,12.75 Q2.1 | 45.95,12.75 45.05,11.85 v45.05,10.95
  Bottom 0.406: C15.2 45.75,13.65 44.95,13.65 v44.2,12.9 | IC5.2 46.2,4.54 45.6,5.15 45.6,8.2 45.05,8.75 v45.05,10.95
N$6
  Top 1.016: J1.1 37.88,10.97 T1.3
N$7  (via drill 0.3)
  Top 0.406: v58.95,15.05 58.95,12.7 58.9,12.75 Q2.2 v53.95,12.75
  Bottom 0.406: C5.2 58.95,13.81 v58.95,15.05 | IC5.3 50.31,5.82 50.7,6.2 50.7,12.3 51.15,12.75 v53.95,12.75
N$8
  pour Top (no thermals): 48.09,44.25 48.09,47.52 57.47,47.52 57.47,43.64 52.64,43.64 52.64,44.25
N$9
  pour Top (no thermals): 46.19,42.8 46.72,42.8 46.72,42.01 47.1,42.01 47.1,36.57 46.01,36.57 46.01,41.99 46.19,41.99
N$10  (via drill 0.3)
  Top 0.406: LED1.A 45.71,8.66 v46.5,9.45
  Bottom 0.406: IC5.5 46.8,8.35 46.5,8.65 v46.5,9.45
N$11
  pour Top (no thermals): 46.72,44.3 46.72,45.42 42.38,45.42 42.38,39.88 43.47,39.88 43.47,44.3
  pour Top (no thermals): 37.27,41.1 43.47,41.1 43.47,38.51 37.27,38.51
N$18
  Top 0.254: CON1.19 16.29,7.42 R7.1
RGB_DE  (via drill 0.31)
  Top 0.254: v29.25,38.65 28.8,38.2 v26.45,38.2
  Top 0.3: CON2.34 17.77,49.18 v17.25,49.7
  Bottom 0.3: R2.3P 26.46,35.94 v26.45,38.2 | v29.25,38.65 29.5,38.65 29.95,39.1 29.95,49.2 27.05,52.1 18.7,52.1 17.4,50.8 17.4,49.85 v17.25,49.7
RGB_DISP  (via drill 0.3)
  Top 0.3: CON2.31 19.27,47.27 v18.95,46.95 | v35.2,41.25 35.17,41.22 R15.1
  Bottom 0.3: v18.95,46.95 18.2,46.95 16.6,48.55 16.6,51.05 18.25,52.7 27.45,52.7 33.6,46.55 33.6,42.7 35.05,41.25 v35.2,41.25
RGB_EVEN_B0  (via drill 0.31)
  Top 0.3: CON2.21 24.27,45.22 9.45,30.4 9.45,18.7 v8.75,18
  Bottom 0.3: R3.4P 9.03,18.28 v8.75,18
RGB_EVEN_B1  (via drill 0.31)
  Top 0.3: CON2.22 23.77,45.52 8.75,30.5 8.75,19.45 8.35,19.05 v8.35,19
  Bottom 0.3: R3.3P 8.43,19.08 v8.35,19
RGB_EVEN_B2  (via drill 0.31)
  Top 0.3: CON2.23 23.27,45.87 8.1,30.7 8.1,20.15 7.85,19.9 v7.85,19.85
  Bottom 0.3: R3.2P 7.88,19.88 v7.85,19.85
RGB_EVEN_B3  (via drill 0.31)
  Top 0.3: CON2.24 22.77,46.22 7.55,31 7.55,21.25 7.35,21.05 v7.35,20.55
  Bottom 0.3: R3.1P 7.48,20.68 v7.35,20.55
RGB_EVEN_B4  (via drill 0.31)
  Top 0.3: CON2.25 22.27,46.57 6.9,31.2 6.9,22.2 6.65,21.95 v6.65,21.55
  Bottom 0.3: R8.4P 6.79,21.68 v6.65,21.55
RGB_EVEN_B5  (via drill 0.31)
  Top 0.3: CON2.26 21.77,46.92 6.3,31.45 6.3,22.7 v5.95,22.35
  Bottom 0.3: R8.3P 6.08,22.48 v5.95,22.35
RGB_EVEN_B6  (via drill 0.31)
  Top 0.3: CON2.27 21.27,47.22 5.7,31.65 5.7,23.65 5.45,23.4 v5.45,23.15
  Bottom 0.3: R8.2P 5.58,23.29 v5.45,23.15
RGB_EVEN_B7  (via drill 0.31)
  Top 0.3: CON2.28 20.77,47.52 4.92,31.66 v4.92,24.09
  Bottom 0.3: R8.1P v4.92,24.09
RGB_EVEN_G0  (via drill 0.31)
  Top 0.3: CON2.13 28.27,50.53 26.05,52.75 16.25,52.75 v15.3,51.8
  Bottom 0.3: v15.3,51.8 7.7,51.8 6.25,50.35 6.25,26.3 7.5,25.05 R9.4P
RGB_EVEN_G1  (via drill 0.31)
  Top 0.3: CON2.14 27.77,50.18 25.95,52 16.5,52 15.35,50.85 v14.8,50.85
  Bottom 0.3: v14.8,50.85 14.55,51.1 7.95,51.1 6.85,50 6.85,26.7 7.7,25.85 R9.3P
RGB_EVEN_G2  (via drill 0.31)
  Top 0.3: CON2.15 27.27,49.83 25.75,51.35 17.05,51.35 15.85,50.15 v15.3,50.15
  Bottom 0.3: R9.2P 10.65,26.6 8.15,26.6 7.45,27.3 7.45,49.4 8.2,50.15 v15.3,50.15
RGB_EVEN_G3  (via drill 0.31)
  Top 0.3: CON2.16 26.77,49.23 25.3,50.7 17.25,50.7 15.9,49.35 14.2,49.35 14.1,49.25 v14.05,49.25
  Bottom 0.3: v14.05,49.25 8.75,49.25 8.1,48.7 8.1,27.8 8.5,27.4 10.65,27.4 R9.1P
RGB_EVEN_G4  (via drill 0.31)
  Top 0.3: CON2.17 26.27,43.92 v25.9,43.55
  Bottom 0.3: R10.4P 15.14,36.54 22.45,43.85 25.6,43.85 v25.9,43.55
RGB_EVEN_G5  (via drill 0.31)
  Top 0.3: CON2.18 25.77,44.37 25.15,43.75 25.15,42.8 v25.2,42.75
  Bottom 0.3: R10.3P 15.94,36.54 22.65,43.25 24.7,43.25 v25.2,42.75
RGB_EVEN_G6  (via drill 0.31)
  Top 0.3: CON2.19 25.27,44.67 24.5,43.9 24.5,42.15 v24.6,42.05
  Bottom 0.3: R10.2P 16.74,36.39 23,42.65 24.15,42.65 24.6,42.2 v24.6,42.05
RGB_EVEN_G7  (via drill 0.31)
  Top 0.3: CON2.20 24.77,44.92 23.5,43.65 v23.5,42
  Bottom 0.3: R10.1P 17.54,36.24 23.3,42 v23.5,42
RGB_EVEN_R0  (via drill 0.31)
  Top 0.3: v18.65,35.4 19,35.4 19.25,35.15 30.85,35.15 32.27,36.57 CON2.5
  Bottom 0.3: R11.4P v18.65,35.4
RGB_EVEN_R1  (via drill 0.31)
  Top 0.3: v19.55,36.15 19.6,36.15 19.85,35.9 30.45,35.9 31.77,37.22 CON2.6
  Bottom 0.3: R11.3P 19.45,36.05 v19.55,36.15
RGB_EVEN_R2  (via drill 0.31)
  Top 0.3: v20.3,36.75 30.15,36.75 31.27,37.87 CON2.7
  Bottom 0.3: R11.2P 20.25,36.7 v20.3,36.75
RGB_EVEN_R3  (via drill 0.31)
  Top 0.3: CON2.8 30.77,38.62 29.55,37.4 21.35,37.4 v21.1,37.65
  Bottom 0.3: R11.1P 21.05,37.6 v21.1,37.65
RGB_EVEN_R4  (via drill 0.31)
  Top 0.3: v22.15,39.4 28.6,39.4 30.27,41.07 CON2.9
  Bottom 0.3: R12.4P 22.13,39.38 v22.15,39.4
RGB_EVEN_R5  (via drill 0.31)
  Top 0.3: v22.95,40.3 28.5,40.3 29.77,41.57 CON2.10
  Bottom 0.3: R12.3P 22.93,40.28 v22.95,40.3
RGB_EVEN_R6  (via drill 0.31)
  Top 0.3: CON2.11 29.27,42.07 28.35,41.15 v24.15,41.15
  Bottom 0.3: R12.2P 23.73,40.73 v24.15,41.15
RGB_EVEN_R7  (via drill 0.31)
  Top 0.3: CON2.12 28.77,42.57 28.1,41.9 v25.6,41.9
  Bottom 0.3: R12.1P 24.53,40.28 25.6,41.35 v25.6,41.9
RGB_HSYNC  (via drill 0.31)
  Top 0.3: CON2.32 18.77,49.42 18.95,49.6 v18.95,49.7
  Bottom 0.3: R2.2P 27.26,49.89 26.45,50.7 19.6,50.7 18.95,50.05 v18.95,49.7 18.95,49.95
RGB_ODCK  (via drill 0.31)
  Top 0.3: CON2.30 19.77,49.57 v19.8,49.6
  Bottom 0.3: R2.4P 25.66,33.94 25.4,34.2 25.4,39.85 26.65,41.1 26.65,49 25.55,50.1 20.3,50.1 v19.8,49.6
RGB_VSYNC  (via drill 0.31)
  Top 0.3: CON2.33 18.27,49.93 18.15,50.05 v18.05,50.05
  Bottom 0.3: R2.1P 28.06,50.09 26.8,51.35 19.05,51.35 18.05,50.35 v18.05,50.05
TOUCH_X+  (via drill 0.31)
  Top 0.254: 16.27,45.62 11.75,41.1 v11.75,40.95 | v12.8,30.2 12.8,19.05 12.6,18.85 12.6,17.4 10.05,14.85 v10.05,12.45 | 46.2,10.45 46.15,10.45 45.7,10 44.65,10 44.2,10.45 44.2,10.5 v44.15,10.55
  Top 0.3: CON2.37 16.27,45.62
  Top 0.406: v46.3,10.45 46.2,10.45
  Bottom 0.254: v11.75,40.95 12.8,39.9 v12.8,30.2 | v44.15,10.55 42.9,10.55 39.05,6.7 37.05,6.7 33.2,2.85 28.25,2.85 26.1,0.7 21.9,0.7 21.75,0.55 18,0.55 15.2,3.35 10.6,3.35 7.05,6.9 7.05,10.9 8.3,12.15 9.75,12.15 v10.05,12.45
  Bottom 0.406: IC5.7 46.74,10.89 v46.3,10.45
TOUCH_X-  (via drill 0.31)
  Top 0.254: 15.27,46.67 10.25,41.65 v10.25,39.9 | v11.25,30.2 11.25,18.2 8.65,15.6 v8.65,10.15 | v53.15,11.9 53.15,13.2 51.25,15.1 43.3,15.1 41.8,13.6 v41.8,11.35
  Top 0.3: CON2.39 15.27,46.67
  Top 0.406: v57.6,10.9 58.66,10.9 R1.2
  Bottom 0.254: v10.25,39.9 11.25,38.9 v11.25,30.2 | v41.8,11.35 41.8,10.25 39.7,8.15 37.35,8.15 32.8,3.6 27.9,3.6 25.7,1.4 21.75,1.4 21.4,1.05 18.35,1.05 15.1,4.3 14.5,4.3 v8.65,10.15
  Bottom 0.406: v57.6,10.9 v57.59,10.89 IC5.14 54.16,10.89 v53.15,11.9
TOUCH_Y+  (via drill 0.31)
  Top 0.254: 14.77,47.22 9.4,41.85 v9.4,39.1 | v10.45,28.7 10.45,18.3 8.05,15.9 v8.05,9.3 | v52.15,11.75 52.15,13.3 50.8,14.65 44.1,14.65 42.9,13.45 42.9,11.35 39.7,8.15 37.35,8.15 32.8,3.6 27.9,3.6 25.7,1.4 18.55,1.4 15.65,4.3 13.05,4.3 v10.2,7.15
  Top 0.3: CON2.40 14.77,47.22
  Bottom 0.254: v9.4,39.1 10.45,38.05 v10.45,28.7 | v10.2,7.15 v8.05,9.3
  Bottom 0.406: IC5.15 54.27,9.62 v52.15,11.75
TOUCH_Y-  (via drill 0.31)
  Top 0.254: 15.77,46.02 11,41.25 v11,40.55 | v12.05,28.75 12.05,17.9 9.3,15.15 9.3,6.7 12.45,3.55 15.15,3.55 18,0.7 26.1,0.7 28.25,2.85 33.2,2.85 37.05,6.7 39.4,6.7 43.4,10.7 43.4,13.15 44.45,14.2 50.4,14.2 51.45,13.15 v51.45,10.8
  Top 0.3: CON2.38 15.77,46.02
  Bottom 0.254: v11,40.55 12.05,39.5 v12.05,28.75
  Bottom 0.406: IC5.16 53.9,8.36 v51.45,10.8
USB_D+  (via drill 0.31)
  Top 0.406: CON4.3 65.83,8.41 v65.83,6.72
  Bottom 0.406: IC7.15 70.02,6.9 69.46,7.47 66.58,7.47 v65.83,6.72
USB_D-  (via drill 0.31)
  Top 0.254: CON4.2
  Top 0.406: CON4.2 65,6.3 65.45,5.85 68.17,5.85 v68.62,6.3
  Bottom 0.406: IC7.16 69.37,5.54 v68.62,6.3
USB_TOUCH_D+  (via drill 0.3)
  Top 0.406: CON3.3 52.45,8.41 v52.45,4.65
  Bottom 0.406: v52.45,4.65 52.55,4.54 IC5.19
USB_TOUCH_D-  (via drill 0.3)
  Top 0.406: CON3.2 51.65,8.41 v51.65,6.4
  Bottom 0.406: v51.65,6.4 52.23,5.82 IC5.18
VCC  (via drill 0.3, 0.31)
  Top 0.254: R7.2 16.26,9.15 17.75,9.15 18.23,8.67 CON1.18 18.23,5.67 20.8,3.1 v21.5,3.1 | 33.8,8.1 28.55,8.1 27.7,7.25 27.7,5.6 25.2,3.1 v21.5,3.1 | 21.6,3.1 v21.5,3.1
  Top 0.3: T1.2 34.98,14.98 33.8,13.8 33.8,8.1
  Top 0.406: CON4.1 64.2,7.95 64.17,7.92 v64.17,6.71 | 51.19,23.93 51.14,23.98 v51.07,23.98 51.2,23.84 IC6.4 51.2,23.75 51.45,24 52.71,24 v52.74,24.03 | IC6.6 52.8,23.97 v52.74,24.03 | IC6.20 52,30.13 52.62,29.52 52.8,29.52 | 52.8,29.52 v53.61,29.52 53.6,29.52 IC6.18 53.6,32.35 54.6,33.35 54.6,34.28 R16.1 56.59,34.33 62.01,39.75 CON5.5 | v52.74,24.03 52.74,29.46 52.8,29.52 | v62.98,24.84 IC4.8 58.94,24.84 v57.85,23.75 | 42.88,19.02 42.7,18.85 | 44.05,20.2 44.05,23.65 v44.1,23.7
  Top 0.8: T1.2 34.98,16.28 35.25,16.55 36.6,16.55 38.12,18.07
  Top 1.016: C19.2 38.84,17.35 38.12,18.07 IC2.3 38.16,18.85 C1.+ | 42.88,19.02 44.05,20.2 44.05,31.4 50.94,38.29 C22.2 | 42.7,18.85 C1.+ | C1.+
  Bottom 0.3: R28.2 R29.2 20.61,2.4 21.3,2.4 21.5,2.6 v21.5,3.1 | C10.2 R17.2 64.29,24.84 | C12.1 63.51,14.12 63.44,14.2
  Bottom 0.406: C9.1 50.24,23.73 | 50.24,23.73 50.48,23.98 v51.07,23.98 | C23.1 52.74,22.54 v52.74,24.03 53.02,23.75 v57.85,23.75 | v53.61,29.52 53.61,30.77 C24.1 | C12.1 63.52,14.1 IC7.4 63.52,8.98 64.17,8.33 v64.17,6.71 65.18,5.7 66.45,5.7 66.77,5.38 IC7.20 IC7.19 | 64.29,24.84 v62.98,24.84 62.98,17.75 62.42,17.2 62.42,14.5 62.73,14.2 63.44,14.2 | 50.24,23.73 44.13,23.73 v44.1,23.7
  pour Top (no thermals): 48.63,42.8 48.09,42.8 48.09,42.01 47.71,42.01 47.71,38.4 57.47,38.4 57.47,42.75 52.67,42.75 52.67,40.46 48.83,40.46 48.83,42.04 48.63,42.04

### Text on the board
tNames: HDMI-RGB V2 | Armin Schlegel | 05.12.2014